# EAGLE design artik530_carrierboard (EAGLE 9.0.0)

## Sheet 1 of 4
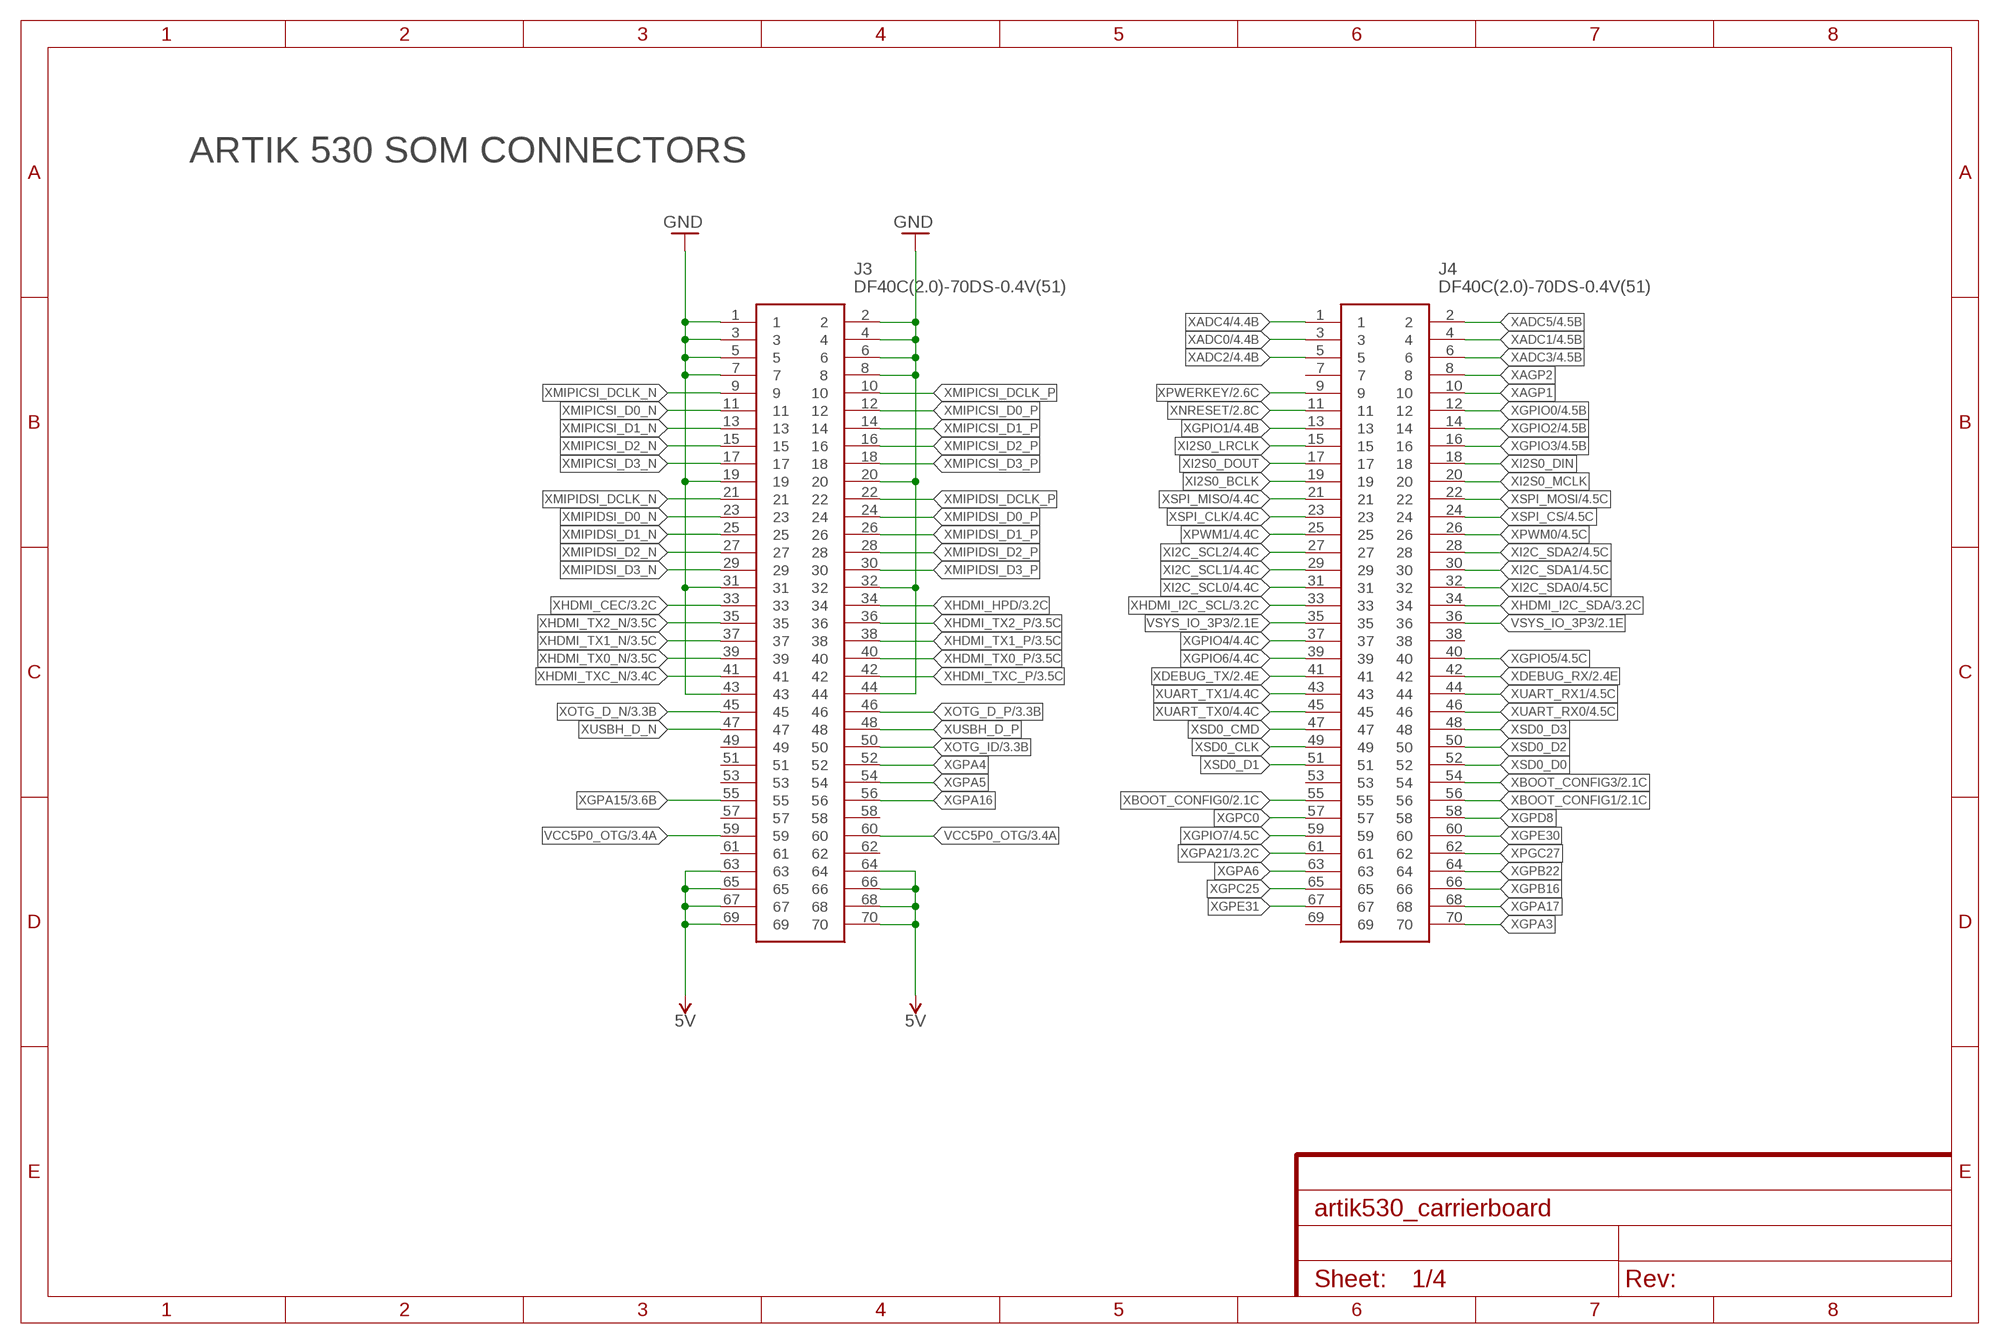
[diagram p0: schematic, sheet 1]

### Parts
J3  DF40C(2.0)-70DS-0.4V(51)  [DF40C(2.0)-70DS-0.4V(51)]
J4  DF40C(2.0)-70DS-0.4V(51)  [DF40C(2.0)-70DS-0.4V(51)]

### Nets
5V: J3.63 J3.64 J3.65 J3.66 J3.67 J3.68 J3.69 J3.70 ; also sheet 2,3,4
GND: J3.1 J3.2 J3.3 J3.4 J3.5 J3.6 J3.7 J3.8 J3.19 J3.20 J3.31 J3.32 J3.43 J3.44 ; also sheet 2,3,4
VCC5P0_OTG: J3.59 J3.60 ; also sheet 3
VSYS_IO_3P3: J4.35 J4.36 ; also sheet 2
XADC0: J4.3 ; also sheet 4
XADC1: J4.4 ; also sheet 4
XADC2: J4.5 ; also sheet 4
XADC3: J4.6 ; also sheet 4
XADC4: J4.1 ; also sheet 4
XADC5: J4.2 ; also sheet 4
XAGP1: J4.10
XAGP2: J4.8
XBOOT_CONFIG0: J4.55 ; also sheet 2
XBOOT_CONFIG1: J4.56 ; also sheet 2
XBOOT_CONFIG3: J4.54 ; also sheet 2
XDEBUG_RX: J4.42 ; also sheet 2
XDEBUG_TX: J4.41 ; also sheet 2
XGPA3: J4.70
XGPA4: J3.52
XGPA5: J3.54
XGPA6: J4.63
XGPA15: J3.55 ; also sheet 3
XGPA16: J3.56
XGPA17: J4.68
XGPA21: J4.61 ; also sheet 3
XGPB16: J4.66
XGPB22: J4.64
XGPC0: J4.57
XGPC25: J4.65
XGPD8: J4.58
XGPE30: J4.60
XGPE31: J4.67
XGPIO0: J4.12 ; also sheet 4
XGPIO1: J4.13 ; also sheet 4
XGPIO2: J4.14 ; also sheet 4
XGPIO3: J4.16 ; also sheet 4
XGPIO4: J4.37 ; also sheet 4
XGPIO5: J4.40 ; also sheet 4
XGPIO6: J4.39 ; also sheet 4
XGPIO7: J4.59 ; also sheet 4
XHDMI_CEC: J3.33 ; also sheet 3
XHDMI_HPD: J3.34 ; also sheet 3
XHDMI_I2C_SCL: J4.33 ; also sheet 3
XHDMI_I2C_SDA: J4.34 ; also sheet 3
XHDMI_TX0_N: J3.39 ; also sheet 3
XHDMI_TX0_P: J3.40 ; also sheet 3
XHDMI_TX1_N: J3.37 ; also sheet 3
XHDMI_TX1_P: J3.38 ; also sheet 3
XHDMI_TX2_N: J3.35 ; also sheet 3
XHDMI_TX2_P: J3.36 ; also sheet 3
XHDMI_TXC_N: J3.41 ; also sheet 3
XHDMI_TXC_P: J3.42 ; also sheet 3
XI2C_SCL0: J4.31 ; also sheet 4
XI2C_SCL1: J4.29 ; also sheet 4
XI2C_SCL2: J4.27 ; also sheet 4
XI2C_SDA0: J4.32 ; also sheet 4
XI2C_SDA1: J4.30 ; also sheet 4
XI2C_SDA2: J4.28 ; also sheet 4
XI2S0_BCLK: J4.19
XI2S0_DIN: J4.18
XI2S0_DOUT: J4.17
XI2S0_LRCLK: J4.15
XI2S0_MCLK: J4.20
XMIPICSI_D0_N: J3.11
XMIPICSI_D0_P: J3.12
XMIPICSI_D1_N: J3.13
XMIPICSI_D1_P: J3.14
XMIPICSI_D2_N: J3.15
XMIPICSI_D2_P: J3.16
XMIPICSI_D3_N: J3.17
XMIPICSI_D3_P: J3.18
XMIPICSI_DCLK_N: J3.9
XMIPICSI_DCLK_P: J3.10
XMIPIDSI_D0_N: J3.23
XMIPIDSI_D0_P: J3.24
XMIPIDSI_D1_N: J3.25
XMIPIDSI_D1_P: J3.26
XMIPIDSI_D2_N: J3.27
XMIPIDSI_D2_P: J3.28
XMIPIDSI_D3_N: J3.29
XMIPIDSI_D3_P: J3.30
XMIPIDSI_DCLK_N: J3.21
XMIPIDSI_DCLK_P: J3.22
XNRESET: J4.11 ; also sheet 2
XOTG_D_N: J3.45 ; also sheet 3
XOTG_D_P: J3.46 ; also sheet 3
XOTG_ID: J3.50 ; also sheet 3
XPGC27: J4.62
XPWERKEY: J4.9 ; also sheet 2
XPWM0: J4.26 ; also sheet 4
XPWM1: J4.25 ; also sheet 4
XSD0_CLK: J4.49
XSD0_CMD: J4.47
XSD0_D0: J4.52
XSD0_D1: J4.51
XSD0_D2: J4.50
XSD0_D3: J4.48
XSPI_CLK: J4.23 ; also sheet 4
XSPI_CS: J4.24 ; also sheet 4
XSPI_MISO: J4.21 ; also sheet 4
XSPI_MOSI: J4.22 ; also sheet 4
XUART_RX0: J4.46 ; also sheet 4
XUART_RX1: J4.44 ; also sheet 4
XUART_TX0: J4.45 ; also sheet 4
XUART_TX1: J4.43 ; also sheet 4
XUSBH_D_N: J3.47
XUSBH_D_P: J3.48
Unconnected: J3.49 J3.51 J3.53 J3.57 J3.58 J3.61 J3.62 J4.7 J4.38 J4.53 J4.69

### Notes on the sheet
- ARTIK 530 SOM CONNECTORS

## Sheet 2 of 4
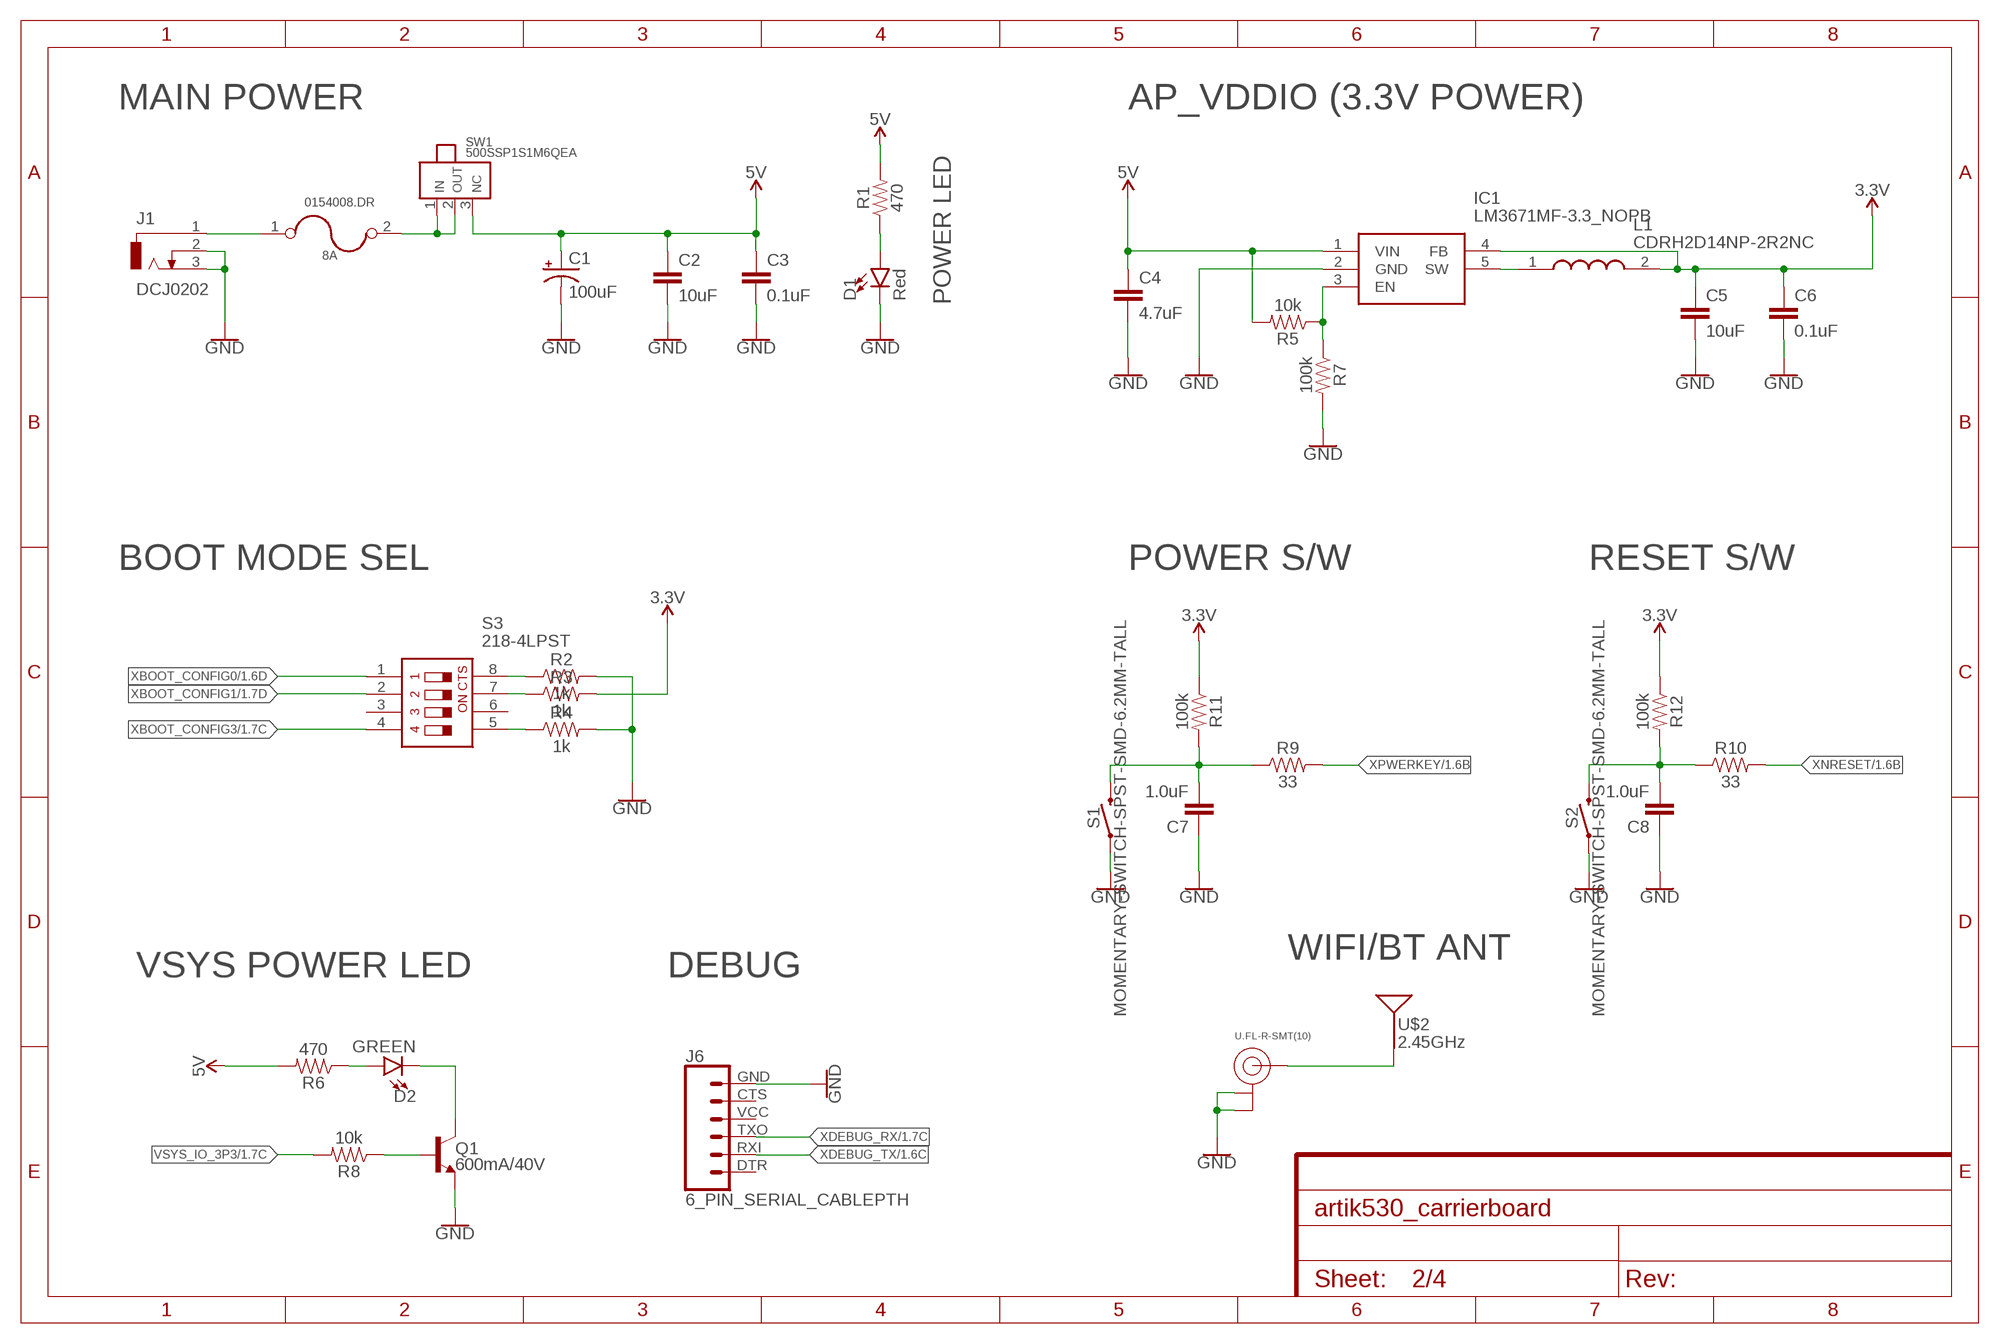
[diagram p1: schematic, sheet 2]

### Parts
C1  100uF  100UF-POLAR-EIA7343-10V-10%(TANT)  [EIA7343]
C2  10uF  10UF-0603-6.3V-20%  [0603]
C3  0.1uF  0.1UF-0603-25V-(+80/-20%)  [0603]
C4  4.7uF  4.7UF-0603-6.3V-(10%)  [0603]
C5  10uF  10UF-0603-6.3V-20%  [0603]
C6  0.1uF  0.1UF-0603-25V-(+80/-20%)  [0603]
C7  1.0uF  1.0UF-0603-16V-10%  [0603]
C8  1.0uF  1.0UF-0603-16V-10%  [0603]
D1  Red  LED-RED0603-SMART  [LED-0603]
D2  GREEN  LED-GREEN0603  [LED-0603]
IC1  LM3671MF-3.3_NOPB  [SOT95P284X122-5N]
J1  DCJ0202  [DCJ0202]
J6  6_PIN_SERIAL_CABLEPTH  [FTDI_BASIC]
L1  CDRH2D14NP-2R2NC  [CDRH2D14]
Q1  600mA/40V  TRANS_NPN-MMBT2222AL  [SOT23-3]
R1  470  470OHM-0603-1/10W-1%  [0603]
R2  1k  1KOHM-0603-1/10W-1%  [0603]
R3  1k  1KOHM-0603-1/10W-1%  [0603]
R4  1k  1KOHM-0603-1/10W-1%  [0603]
R5  10k  10KOHM-0603-1/10W-1%  [0603]
R6  470  470OHM-0603-1/10W-1%  [0603]
R7  100k  100KOHM-0603-1/10W-1%  [0603]
R8  10k  10KOHM-0603-1/10W-1%  [0603]
R9  33  33OHM-0603-1/10W-1%  [0603]
R10  33  33OHM-0603-1/10W-1%  [0603]
R11  100k  100KOHM-0603-1/10W-1%  [0603]
R12  100k  100KOHM-0603-1/10W-1%  [0603]
S1  MOMENTARY-SWITCH-SPST-SMD-6.2MM-TALL  [TACTILE_SWITCH_SMD_6.2MM_TALL]
S2  MOMENTARY-SWITCH-SPST-SMD-6.2MM-TALL  [TACTILE_SWITCH_SMD_6.2MM_TALL]
S3  218-4LPST  [SOIC127P844X265-8N]
SW1  500SSP1S1M6QEA  [500SSP1S1M6QEA]
U$1  0154008.DR  [0154008.DR]
U$2  2.45GHz  ANTENNA2.4GHZ-6.5X2.2MM  [ANT-2.4GHZ-6.5X2.2MM]
U$3  U.FL-R-SMT(10)  [U.FL-R-SMT(10)]

### Nets
3.3V: C5.1 C6.1 IC1.4(FB) L1.2 R3.2 R11.1 R12.1 ; also sheet 3,4
5V: C1.A(+) C2.1 C3.1 C4.1 IC1.1(VIN) R1.2 R5.2 R6.2 SW1.3(NC) ; also sheet 1,3,4
GND: C1.C(-) C2.2 C3.2 C4.2 C5.2 C6.2 C7.1 C8.1 D1.C IC1.2(GND) J1.2 J1.3 J6.GND Q1.2(E) R2.2 R4.2 R7.2 S1.A2 S2.A2 U$3.1(GND1) U$3.2(GND2) ; also sheet 1,3,4
N$1: J1.1 U$1.1
N$2: SW1.1(IN) SW1.2(OUT) U$1.2
N$3: IC1.5(SW) L1.1
N$4: D1.A R1.1
N$5: R2.1 S3.8
N$6: R3.1 S3.7
N$7: R4.1 S3.5
N$8: D2.A R6.1
N$9: IC1.3(EN) R5.1 R7.1
N$10: D2.C Q1.3(C)
N$11: Q1.1(B) R8.1
N$12: C7.2 R9.1 R11.2 S1.B2
N$13: C8.2 R10.1 R12.2 S2.B2
N$32: U$2.FEED(SIGNAL) U$3.3(SIG)
VSYS_IO_3P3: R8.2 ; also sheet 1
XBOOT_CONFIG0: S3.1 ; also sheet 1
XBOOT_CONFIG1: S3.2 ; also sheet 1
XBOOT_CONFIG3: S3.4 ; also sheet 1
XDEBUG_RX: J6.TXO ; also sheet 1
XDEBUG_TX: J6.RXI ; also sheet 1
XNRESET: R10.2 ; also sheet 1
XPWERKEY: R9.2 ; also sheet 1
Unconnected: J6.CTS J6.DTR J6.VCC S3.3 S3.6

### Notes on the sheet
- MAIN POWER | AP_VDDIO (3.3V POWER)
- POWER LED
- BOOT MODE SEL | POWER S/W | RESET S/W
- WIFI/BT ANT
- VSYS POWER LED | DEBUG

## Sheet 3 of 4
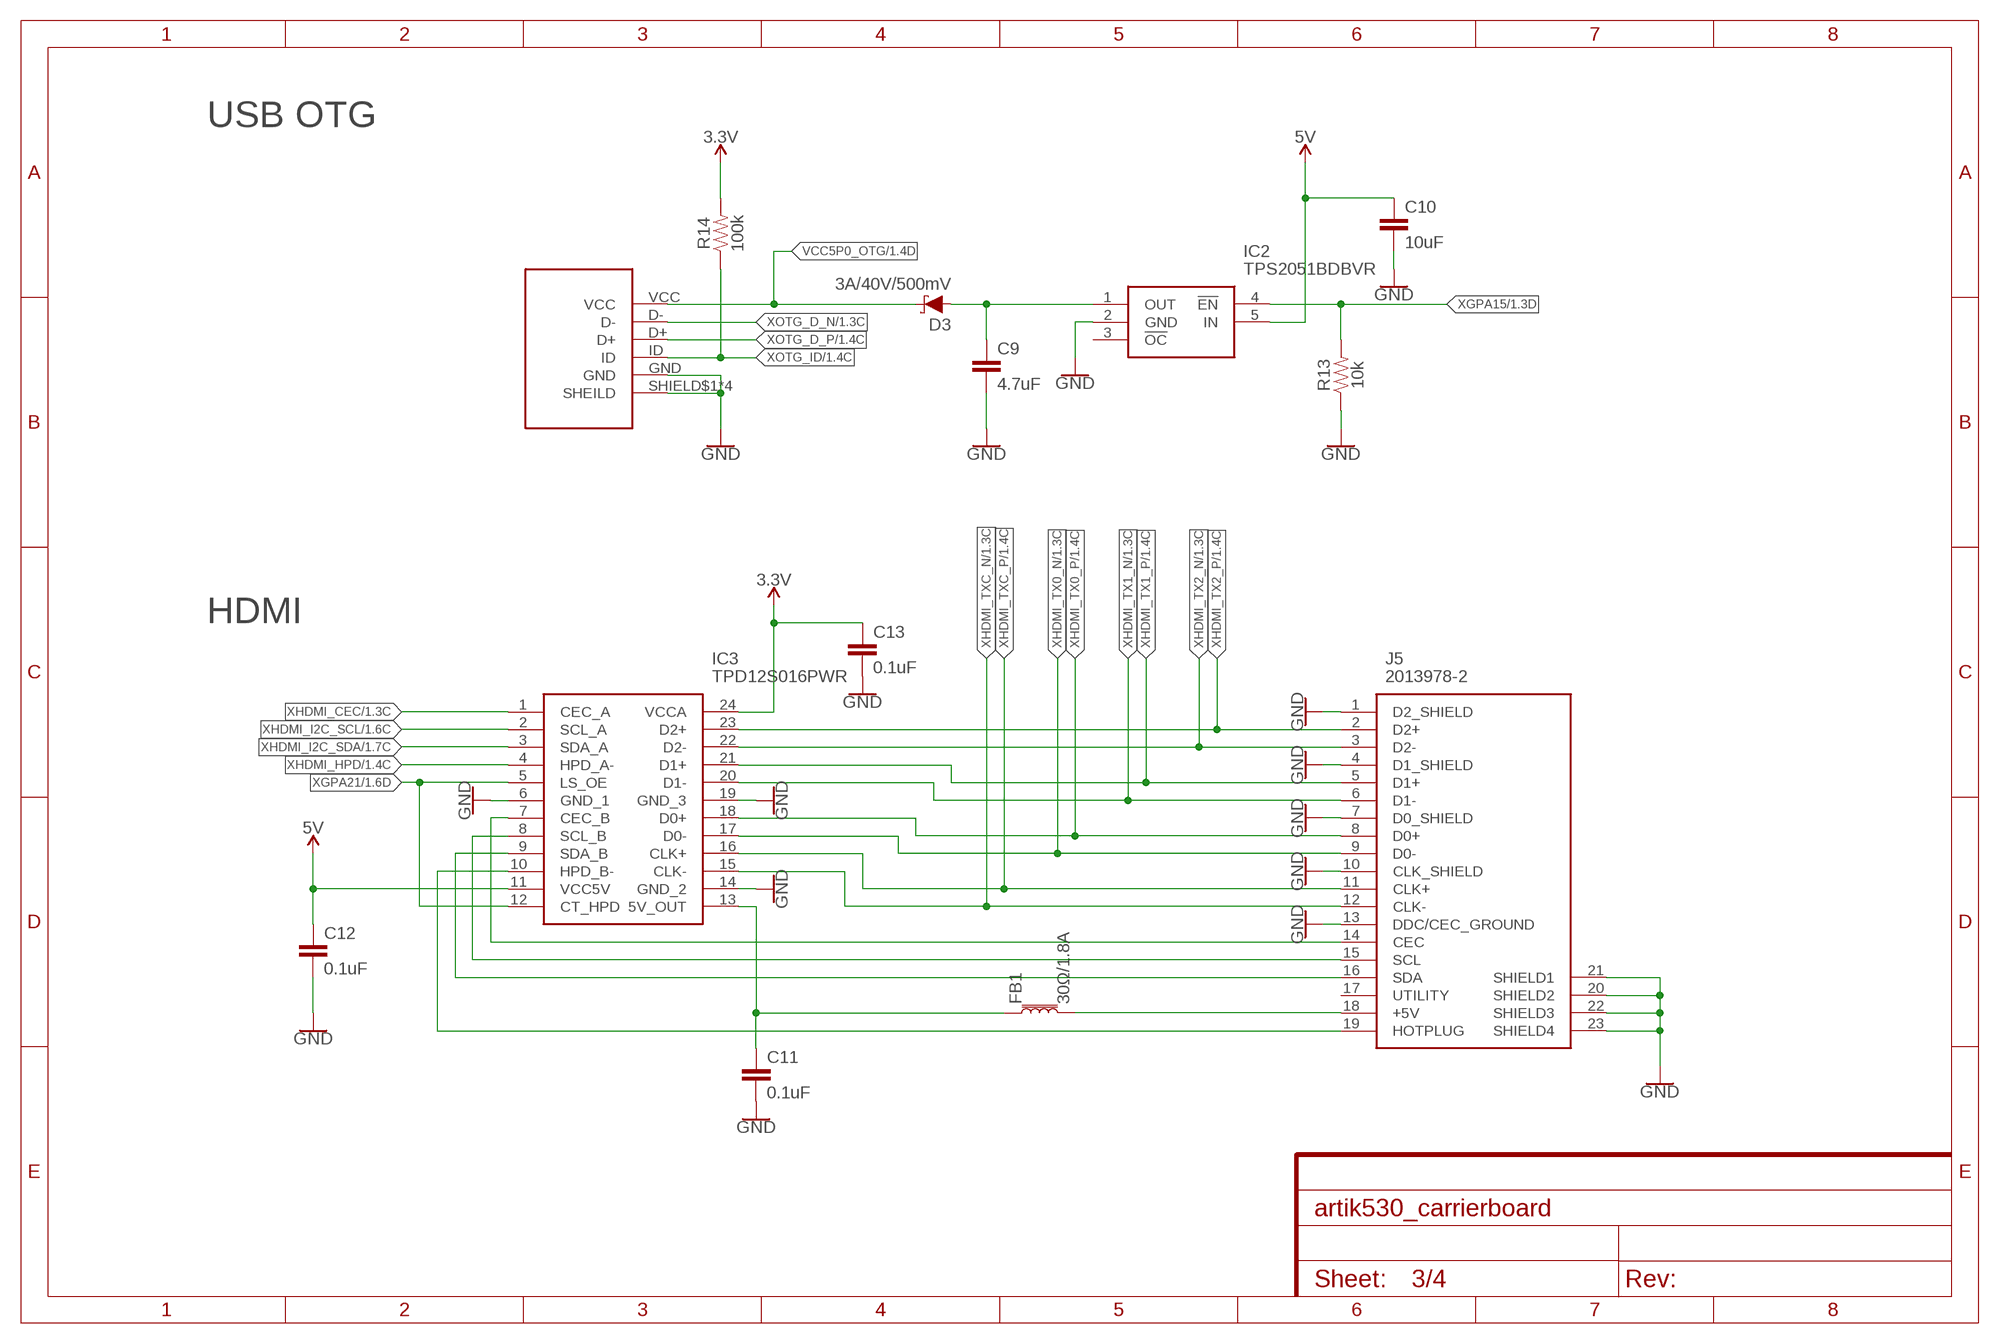
[diagram p2: schematic, sheet 3]

### Parts
C9  4.7uF  4.7UF-0603-6.3V-(10%)  [0603]
C10  10uF  10UF-0603-6.3V-20%  [0603]
C11  0.1uF  0.1UF-0603-25V-(+80/-20%)  [0603]
C12  0.1uF  0.1UF-0603-25V-(+80/-20%)  [0603]
C13  0.1uF  0.1UF-0603-25V-(+80/-20%)  [0603]
D3  3A/40V/500mV  DIODE-SCHOTTKY-B340A  [SMA-DIODE]
FB1  30Ω/1.8A  FERRITE_BEAD-0603  [0603]
IC2  TPS2051BDBVR  [SOT95P280X145-5N]
IC3  TPD12S016PWR  [SOP65P640X120-24N]
J2  10118193-0001LF  [10118193-0001LF]
J5  2013978-2  [20139782]
R13  10k  10KOHM-0603-1/10W-1%  [0603]
R14  100k  100KOHM-0603-1/10W-1%  [0603]

### Nets
3.3V: C13.1 IC3.24(VCCA) R14.2 ; also sheet 2,4
5V: C10.1 C12.1 IC2.5(IN) IC3.11(VCC5V) ; also sheet 1,2,4
GND: C9.2 C10.2 C11.2 C12.2 C13.2 IC2.2(GND) IC3.6(GND_1) IC3.14(GND_2) IC3.19(GND_3) J2.GND J2.SHIELD$1(SHEILD) J2.SHIELD$2(SHEILD) J2.SHIELD$3(SHEILD) J2.SHIELD$4(SHEILD) J5.1(D2_SHIELD) J5.4(D1_SHIELD) J5.7(D0_SHIELD) J5.10(CLK_SHIELD) J5.13(DDC/CEC_GROUND) J5.20(SHIELD2) J5.21(SHIELD1) J5.22(SHIELD3) J5.23(SHIELD4) R13.1 ; also sheet 1,2,4
N$14: C11.1 FB1.1 IC3.13(5V_OUT)
N$15: C9.1 D3.A IC2.1(OUT)
N$16: IC3.7(CEC_B) J5.14(CEC)
N$17: IC3.8(SCL_B) J5.15(SCL)
N$18: IC3.9(SDA_B) J5.16(SDA)
N$19: IC3.10(HPD_B-) J5.19(HOTPLUG)
N$27: FB1.2 J5.18(+5V)
VCC5P0_OTG: D3.C J2.VCC ; also sheet 1
XGPA15: IC2.4(!EN) R13.2 ; also sheet 1
XGPA21: IC3.5(LS_OE) IC3.12(CT_HPD) ; also sheet 1
XHDMI_CEC: IC3.1(CEC_A) ; also sheet 1
XHDMI_HPD: IC3.4(HPD_A-) ; also sheet 1
XHDMI_I2C_SCL: IC3.2(SCL_A) ; also sheet 1
XHDMI_I2C_SDA: IC3.3(SDA_A) ; also sheet 1
XHDMI_TX0_N: IC3.17(D0-) J5.9(D0-) ; also sheet 1
XHDMI_TX0_P: IC3.18(D0+) J5.8(D0+) ; also sheet 1
XHDMI_TX1_N: IC3.20(D1-) J5.6(D1-) ; also sheet 1
XHDMI_TX1_P: IC3.21(D1+) J5.5(D1+) ; also sheet 1
XHDMI_TX2_N: IC3.22(D2-) J5.3(D2-) ; also sheet 1
XHDMI_TX2_P: IC3.23(D2+) J5.2(D2+) ; also sheet 1
XHDMI_TXC_N: IC3.15(CLK-) J5.12(CLK-) ; also sheet 1
XHDMI_TXC_P: IC3.16(CLK+) J5.11(CLK+) ; also sheet 1
XOTG_D_N: J2.D- ; also sheet 1
XOTG_D_P: J2.D+ ; also sheet 1
XOTG_ID: J2.ID R14.1 ; also sheet 1
Unconnected: IC2.3(!OC) J5.17(UTILITY)

### Notes on the sheet
- USB OTG
- HDMI

## Sheet 4 of 4
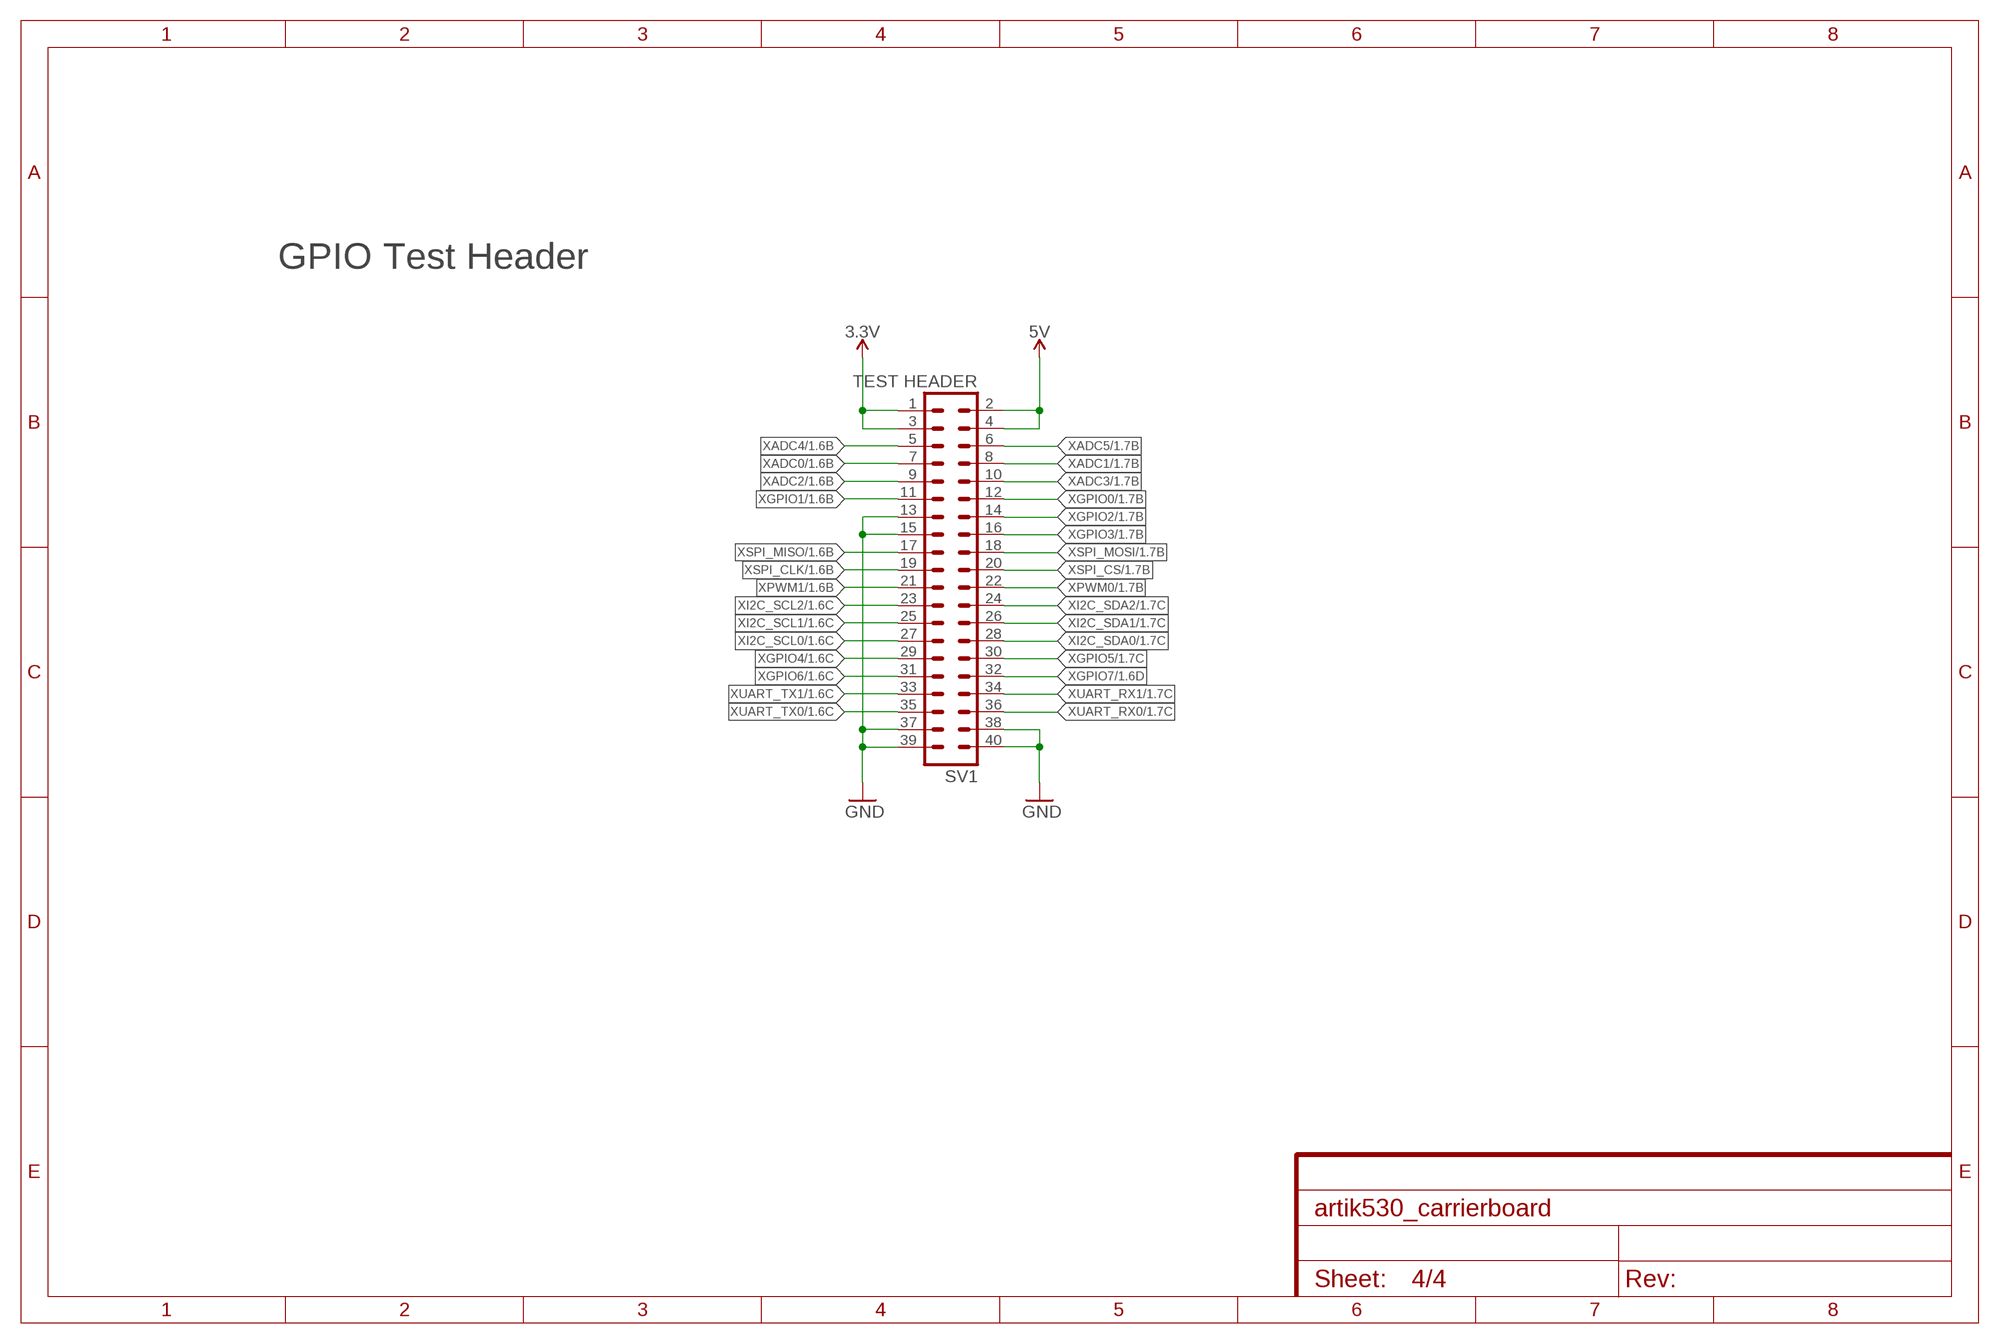
[diagram p3: schematic, sheet 4]

### Parts
SV1  TEST HEADER  MA20-2  [MA20-2]

### Nets
3.3V: SV1.1 SV1.3 ; also sheet 2,3
5V: SV1.2 SV1.4 ; also sheet 1,2,3
GND: SV1.13 SV1.15 SV1.37 SV1.38 SV1.39 SV1.40 ; also sheet 1,2,3
XADC0: SV1.7 ; also sheet 1
XADC1: SV1.8 ; also sheet 1
XADC2: SV1.9 ; also sheet 1
XADC3: SV1.10 ; also sheet 1
XADC4: SV1.5 ; also sheet 1
XADC5: SV1.6 ; also sheet 1
XGPIO0: SV1.12 ; also sheet 1
XGPIO1: SV1.11 ; also sheet 1
XGPIO2: SV1.14 ; also sheet 1
XGPIO3: SV1.16 ; also sheet 1
XGPIO4: SV1.29 ; also sheet 1
XGPIO5: SV1.30 ; also sheet 1
XGPIO6: SV1.31 ; also sheet 1
XGPIO7: SV1.32 ; also sheet 1
XI2C_SCL0: SV1.27 ; also sheet 1
XI2C_SCL1: SV1.25 ; also sheet 1
XI2C_SCL2: SV1.23 ; also sheet 1
XI2C_SDA0: SV1.28 ; also sheet 1
XI2C_SDA1: SV1.26 ; also sheet 1
XI2C_SDA2: SV1.24 ; also sheet 1
XPWM0: SV1.22 ; also sheet 1
XPWM1: SV1.21 ; also sheet 1
XSPI_CLK: SV1.19 ; also sheet 1
XSPI_CS: SV1.20 ; also sheet 1
XSPI_MISO: SV1.17 ; also sheet 1
XSPI_MOSI: SV1.18 ; also sheet 1
XUART_RX0: SV1.36 ; also sheet 1
XUART_RX1: SV1.34 ; also sheet 1
XUART_TX0: SV1.35 ; also sheet 1
XUART_TX1: SV1.33 ; also sheet 1

### Notes on the sheet
- GPIO Test Header

## Library data of the parts
C1 = SparkFun-Capacitors:100UF-POLAR: 100µF polarized capacitors A capacitor is a passive two-terminal electrical component used to store electrical energy temporarily in an electric field.; PROD_ID: CAP-07890
C2 C5 C10 = SparkFun-Capacitors:10UF: 10.0µF ceramic capacitors A capacitor is a passive two-terminal electrical component used to store electrical energy temporarily in an electric field.; PROD_ID: CAP-11015
C3 C6 C11-C13 = SparkFun-Capacitors:0.1UF: 0.1µF ceramic capacitors A capacitor is a passive two-terminal electrical component used to store electrical energy temporarily in an electric field.; PROD_ID: CAP-00810
C4 C9 = SparkFun-Capacitors:4.7UF: 4.7µF ceramic capacitors A capacitor is a passive two-terminal electrical component used to store electrical energy temporarily in an electric field.; PROD_ID: CAP-08280
C7 C8 = SparkFun-Capacitors:1.0UF: 1µF ceramic capacitors A capacitor is a passive two-terminal electrical component used to store electrical energy temporarily in an electric field.; PROD_ID: CAP-00868
D1 = SparkFun-LED:LED-RED: Red SMD LED Used in manufacturing of most products at SparkFun Packages: 0603 - SMD 0603 package [Product Link] <http://docs.avagotech.com/docs/AV02-0551EN> 0603 SMART - SMD 0603 SMART package ( more efficient and expensive)[Product Link] <http://www.osram-os.com/Graphics/XPic2/00077099_0.pdf> 1206 - SMD1206 package [Product Link] <https://www.sparkfun.com/datasheets/DevTools/LilyPad/Q150OVS4.pdff> SparkFun Products: Pro Mini 328 -5V <https://www.sparkfun.com/products/821> RedBoard <https://www.sparkfun.com/products/12757> IOIO-OTG <https://www.sparkfun.com/products/13613>; PROD_ID: DIO-11154
D2 = SparkFun-LED:LED-GREEN: Green SMD LED Used in manufacturing of various products at SparkFun Packages: 0603 - SMD 0603 package [Product Link] <http://www.futureelectronics.com/en/technologies/semiconductors/optoelectronics/leds/Pages/9894312-LTST-C190GKT.aspx?CrossPart=HSMG-C190&IM=0> LilyPad 1206 - SMD1206 LilyPad package [Product Link] <http://www.futureelectronics.com/en/Technologies/Product.aspx?ProductID=IN150NGHARVATEKCORPORATION2049943&IM=0> 1206 - SMD1206 package [Product Link] <http://www.futureelectronics.com/en/technologies/semiconductors/optoelectronics/leds/Pages/8315665-LTST-C150KGKT.aspx?IM=0> 1206 Bottom Mount -SMD 1206 Bottom Mount [Product Link] <http://www.digikey.com/product-detail/en/lite-on-inc/LTST-C230KGKT/160-1456-1-ND/386854> SparkFun Products: Pro Mini 328 -5V <https://www.sparkfun.com/products/821> RedBoard <https://www.sparkfun.com/products/12757> MP3 Trigger <https://www.sparkfun.com/products/13720> Makey Makey <https://www.sparkfun.com/products/11076>; PROD_ID: DIO-00821
D3 = SparkFun-DiscreteSemi:DIODE-SCHOTTKY: Schottky diode A Schottky diode is a semiconductor diode which has a low forward voltage drop and a very fast switching action.; PROD_ID: DIO-09886
FB1 = SparkFun-Coils:FERRITE_BEAD: Ferrite Bead (blocks, cores, rings, chokes, etc.) Inductor with layers of ferrite used to suppress high frequencies. Often used to isolate high frequency noise. SparkFun Products: IOIO-OTG - V2.2 <https://www.sparkfun.com/products/13613> SparkFun SAMD21 Mini Breakout <https://www.sparkfun.com/products/13664> SparkFun 6 Degrees of Freedom Breakout - LSM6DS3 <https://www.sparkfun.com/products/13339> SparkFun SAMD21 Dev Breakout <https://www.sparkfun.com/products/13672>; PROD_ID: NDUC-13805
IC1 = LM3671MF-3.3_NOPB:LM3671MF-3.3_NOPB: DC-DC Converter Step-Dn 2.7-5.5V SOT23-5 Texas Instruments LM3671MF-3.3/NOPB, Step Down DC-DC Converter, 600mA, Adjustable, 1.1 3.3 V, 5-Pin SOT-23 Source: Datasheet <http://www.ti.com/lit/ds/symlink/lm3671.pdf>; DESCRIPTION: DC-DC Converter Step-Dn 2.7-5.5V SOT23-5 Texas Instruments LM3671MF-3.3/NOPB, Step Down DC-DC Converter, 600mA, Adjustable, 1.1 3.3 V, 5-Pin SOT-23; DIGIKEY_PART_NUMBER: LM3671MF-3.3/NOPBTR-ND; HEIGHT: 1.22mm; MANUFACTURER_NAME: Texas Instruments; MANUFACTURER_PART_NUMBER: LM3671MF-3.3/NOPB
IC2 = TPS2051BDBVR:TPS2051BDBVR: TEXAS INSTRUMENTS - TPS2051BDBVR - CURRENT LIMITED POWER SWITCH, 5.5V SOT23-5, FULL REEL Source: Datasheet <http://www.ti.com/lit/ds/symlink/tps2051b.pdf>; ARROW_PART_NUMBER: TPS2051BDBVR; ARROW_PRICE/STOCK: https://www.arrow.com/en/products/tps2051bdbvr/texas-instruments; DESCRIPTION: TEXAS INSTRUMENTS - TPS2051BDBVR - CURRENT LIMITED POWER SWITCH, 5.5V SOT23-5, FULL REEL; HEIGHT: 1.45mm; MANUFACTURER_NAME: Texas Instruments; MANUFACTURER_PART_NUMBER: TPS2051BDBVR
IC3 = TPD12S016PWR:TPD12S016PWR: Texas Instruments,TPD12S016PWR,IC,HDMI TPD12S016PWR, HDMI Interface 12-channel HDMI 4.5 Source: Datasheet <http://www.ti.com/lit/ds/symlink/tpd12s016.pdf>; ARROW_PART_NUMBER: TPD12S016PWR; ARROW_PRICE/STOCK: https://www.arrow.com/en/products/tpd12s016pwr/texas-instruments; DESCRIPTION: Texas Instruments,TPD12S016PWR,IC,HDMI TPD12S016PWR, HDMI Interface 12-channel HDMI 4.5; HEIGHT: 1.2mm; MANUFACTURER_NAME: Texas Instruments; MANUFACTURER_PART_NUMBER: TPD12S016PWR; RS_PART_NUMBER: 1627865; RS_PRICE/STOCK: http://uk.rs-online.com/web/p/products/1627865
J1 = con-jack:DCJ0202: DC POWER JACK Source: DCJ0202.pdf; OC_FARNELL: unknown; OC_NEWARK: unknown
J2 = 10118193-0001LF:10118193-0001LF
J3 J4 = DF40C(2.0)-70DS-0.4V(51):DF40C(2.0)-70DS-0.4V(51): HIROSE(HRS) - DF40C(2.0)-70DS-0.4V(51) - CONNECTOR, STACKING, RCPT, 70POS, 2ROW Source: Datasheet <https://www.hirose.co.jp/cataloge_hp/ed_DF40_20140305.pdf>; ARROW_PART_NUMBER: DF40C(2.0)-70DS-0.4V(51); ARROW_PRICE/STOCK: https://www.arrow.com/en/products/df40c-2.0-70ds-0.4v-51/hirose-electric; DESCRIPTION: HIROSE(HRS) - DF40C(2.0)-70DS-0.4V(51) - CONNECTOR, STACKING, RCPT, 70POS, 2ROW; HEIGHT: mm; MANUFACTURER_NAME: Hirose; MANUFACTURER_PART_NUMBER: DF40C(2.0)-70DS-0.4V(51)
J5 = 2013978-2:2013978-2: TE CONNECTIVITY - 2013978-2 - RECEPTACLE, HDMI, MINI, C, FLANGE Source: Datasheet <http://www.te.com/commerce/DocumentDelivery/DDEController?Action=showdoc&DocId=Customer Drawing2013978B1pdfEnglishENG_CD_2013978_B1.pdf2013978-2>; ARROW_PART_NUMBER: 2013978-2; ARROW_PRICE/STOCK: https://www.arrow.com/en/products/2013978-2/te-connectivity; DESCRIPTION: TE CONNECTIVITY - 2013978-2 - RECEPTACLE, HDMI, MINI, C, FLANGE; HEIGHT: 3mm; MANUFACTURER_NAME: TE Connectivity; MANUFACTURER_PART_NUMBER: 2013978-2
J6 = SparkFun-Connectors:6_PIN_SERIAL_CABLE: 6-pin header connection for use with the "FTDI BASIC" pinout - CABLE SIDE. Also known as "Arduino Serial Program Header". This is used on a design to provide a 6-pin connection point for serial communication usually from a USB cable (D+/D-) to these headers (RX/TX). It also has the remaining pins necessary for programming in the Arduino evironment (DTR, GND, and sometimes VCC). Note, this device has "CABLE" in the name. It is intended to be used on a design that usually lives on the end of your USB cable and prvides the converter chip (FTDI232 or FTDI231x) to commnicate serial RX/TX. The "sister" device, named "TARGET" is inteneded to be used on a design that contains a target micro-controller that you wish to program. You can populate with some of these: Female Headers <https://www.sparkfun.com/products/115> (PRT-00115) For reference (or to suit your programming needs) check out these designs: SparkFun FTDI Basic Breakout - 5V <https://www.sparkfun.com/products/9716> (DEV-09716) SparkFun FTDI Basic Breakout - 3.3V <https://www.sparkfun.com/products/9873> (DEV-09873) SparkFun FTDI SmartBasic <https://www.sparkfun.com/products/12935> (DEV-12935) SparkFun Beefy 3 - FTDI Basic Breakout <https://www.sparkfun.com/products/13746> (DEV-13746)
L1 = CDRH2D14NP-2R2NC:CDRH2D14NP-2R2NC: Fixed Inductors 2.2uH 1.60A 75ohms Source: Datasheet <http://www.mouser.com/ds/2/390/CDRH2D14-523410.pdf>; ARROW_PART_NUMBER: CDRH2D14NP-2R2NC; ARROW_PRICE/STOCK: https://www.arrow.com/en/products/cdrh2d14np-2r2nc/sumida; DESCRIPTION: Fixed Inductors 2.2uH 1.60A 75ohms; HEIGHT: mm; MANUFACTURER_NAME: Sumida; MANUFACTURER_PART_NUMBER: CDRH2D14NP-2R2NC
Q1 = SparkFun-DiscreteSemi:TRANS_NPN: NPN transistor Current controlled devices typically used to amplify current or used as a switch. BC547 - COM-08928 <http://www.sparkfun.com/products/8928> (TO-92 45V 100mA) (1.Collector 2.Base 3.Emitter) 2N3904 - COM-00521 <http://www.sparkfun.com/products/521> (TO-92 40V 200mA) (1.Emitter 2.Base 3.Collector) P2N2222A - COM-12852 <http://www.sparkfun.com/products/12852> (TO-92 40V 600mA) (1.Collector 2.Base 3.Emitter); PROD_ID: TRANS-08049
R1 R6 = SparkFun-Resistors:470OHM: 470Ω resistor A resistor is a passive two-terminal electrical component that implements electrical resistance as a circuit element. Resistors act to reduce current flow, and, at the same time, act to lower voltage levels within circuits. - Wikipedia; PROD_ID: RES-07869
R2-R4 = SparkFun-Resistors:1KOHM: 1kΩ resistor A resistor is a passive two-terminal electrical component that implements electrical resistance as a circuit element. Resistors act to reduce current flow, and, at the same time, act to lower voltage levels within circuits. - Wikipedia; PROD_ID: RES-07856
R5 R8 R13 = SparkFun-Resistors:10KOHM: 10kΩ resistor A resistor is a passive two-terminal electrical component that implements electrical resistance as a circuit element. Resistors act to reduce current flow, and, at the same time, act to lower voltage levels within circuits. - Wikipedia; PROD_ID: RES-00824
R7 R11 R12 R14 = SparkFun-Resistors:100KOHM: 100kΩ resistor A resistor is a passive two-terminal electrical component that implements electrical resistance as a circuit element. Resistors act to reduce current flow, and, at the same time, act to lower voltage levels within circuits. - Wikipedia; PROD_ID: RES-07828
R9 R10 = SparkFun-Resistors:33OHM: 33Ω resistor A resistor is a passive two-terminal electrical component that implements electrical resistance as a circuit element. Resistors act to reduce current flow, and, at the same time, act to lower voltage levels within circuits. - Wikipedia; PROD_ID: RES-08270
S1 S2 = SparkFun-Switches:MOMENTARY-SWITCH-SPST: Momentary Switch (Pushbutton) - SPST Normally-open (NO) SPST momentary switches (buttons, pushbuttons). Variants PTH-12MM - 12mm square, through-hole Momentary Pushbutton Switch - 12mm Square <https://www.sparkfun.com/products/9190> (COM-09190) PTH-6.0MM, PTH-6.0MM-KIT - 6.0mm square, through-hole Mini Pushbutton Switch <https://www.sparkfun.com/products/97> (COM-00097) KIT package intended for soldering kit's - only one side of pads' copper is exposed. PTH-RIGHT-ANGLE-KIT - Right-angle, through-hole Right Angle Tactile Button <https://www.sparkfun.com/products/10791> - Used on SparkFun BigTime Watch Kit <https://www.sparkfun.com/products/11734> SMD-12MM - 12mm square, surface-mount Tactile Button - SMD (12mm) <https://www.sparkfun.com/products/12993> (COM-12993) Used on SparkFun PicoBoard <https://www.sparkfun.com/products/11888> SMD-4.5MM - 4.5mm Square Trackball Switch Used on SparkFun Blackberry Trackballer Breakout <https://www.sparkfun.com/products/13169> SMD-4.6MMX2.8MM - 4.60mm x 2.80mm, surface mount Used on SparkFun SAMD21 Mini Breakout <https://www.sparkfun.com/products/13664> SMD-5.2MM, SMD-5.2-REDUNDANT - 5.2mm square, surface-mount Mini Pushbutton Switch - SMD <https://www.sparkfun.com/products/8720> (COM-08720) Used on Arduino Pro Mini <https://www.sparkfun.com/products/11114> REDUNDANT package connects both switch circuits together SMD-6.0X3.5MM - 6.0 x 3.5mm, surface mount Momentary Reset Switch SMD <https://www.sparkfun.com/products/8229> (COM-08229) SMD-6.2MM-TALL - 6.2mm square, surface mount Tactile Button - SMD (6mm) <https://www.sparkfun.com/products/12992> Used on SparkFun Digital Sandbox <https://www.sparkfun.com/products/12651> SMD-RIGHT-ANGLE - Right-angle, surface mount Used on SparkFun Block for Intel® Edison - Arduino <https://www.sparkfun.com/products/13036>; PROD_ID: SWCH-11966; SF_SKU: COM-12992
S3 = 218-4LPST:218-4LPST: Half Pitch, SMD DIP Switch Source: Datasheet <https://www.ctscorp.com/wp-content/uploads/218.pdf>; ARROW_PART_NUMBER: 218-4LPST; ARROW_PRICE/STOCK: https://www.arrow.com/en/products/218-4lpst/cts; DESCRIPTION: Half Pitch, SMD DIP Switch; HEIGHT: 2.65mm; MANUFACTURER_NAME: CTS; MANUFACTURER_PART_NUMBER: 218-4LPST
SV1 = con-lstb:MA20-2: PIN HEADER; OC_FARNELL: unknown; OC_NEWARK: unknown
SW1 = ARTIK530_EAGLE_LIB:500SSP1S1M6QEA
U$1 = ARTIK530_EAGLE_LIB:0154008.DR: FUSE 8A
U$2 = SparkFun-RF:ANTENNA: Single-ended Antennae 2.4GHz and antennae with just one terminal. These are all chip antennae. 2.4GHz (WiFi/BT/ZigBee) Antennae ANT-2.4GHZ-6.5X2.2MM - 6.5 x 2.2 mm chip antenna. (SparkFun Product <https://www.sparkfun.com/products/144>) ANT-2.4GHZ8.0X1.0MM - 8.0 x 1.0 mm chip antenna. (Datasheet <http://www.mouser.com/ds/2/611/antenna_2500at44m0400-242425.pdf>) ANT-2.4GHZ9.5X2.0MM - 9.5 x 2.0 mm chip antenna. (SparkFun Product <https://www.sparkfun.com/products/9025>); PROD_ID: ANT-08187; SF_ID: WRL-00144
U$3 = ARTIK530_EAGLE_LIB:U.FL-R-SMT(10)

## Net classes
1 differential: width 0.127 mm, drill 0.3 mm, clearance 0.127 mm

## Board
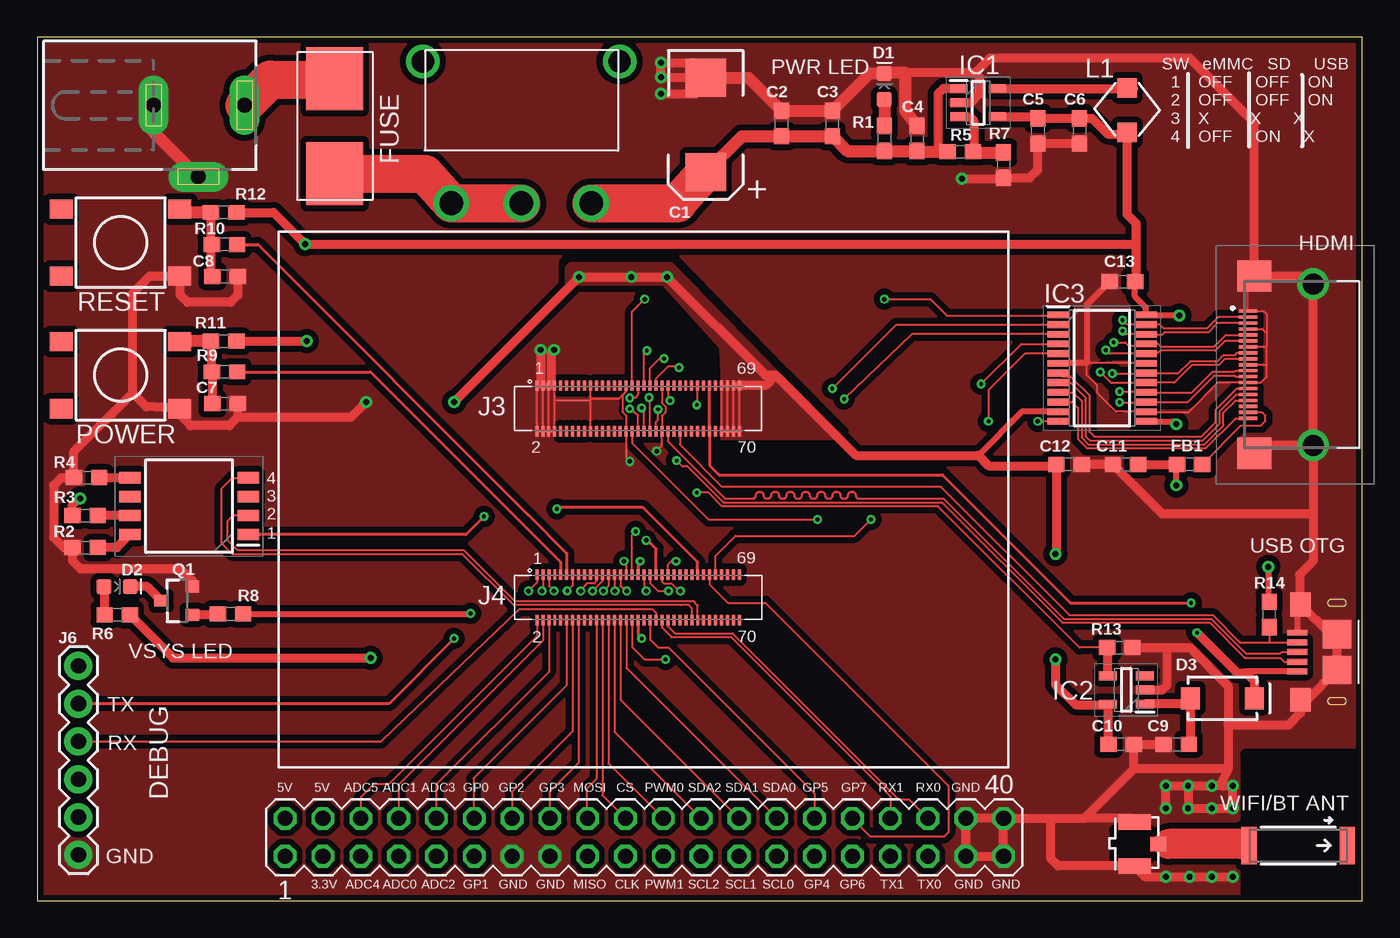
[diagram p4: board, top side]
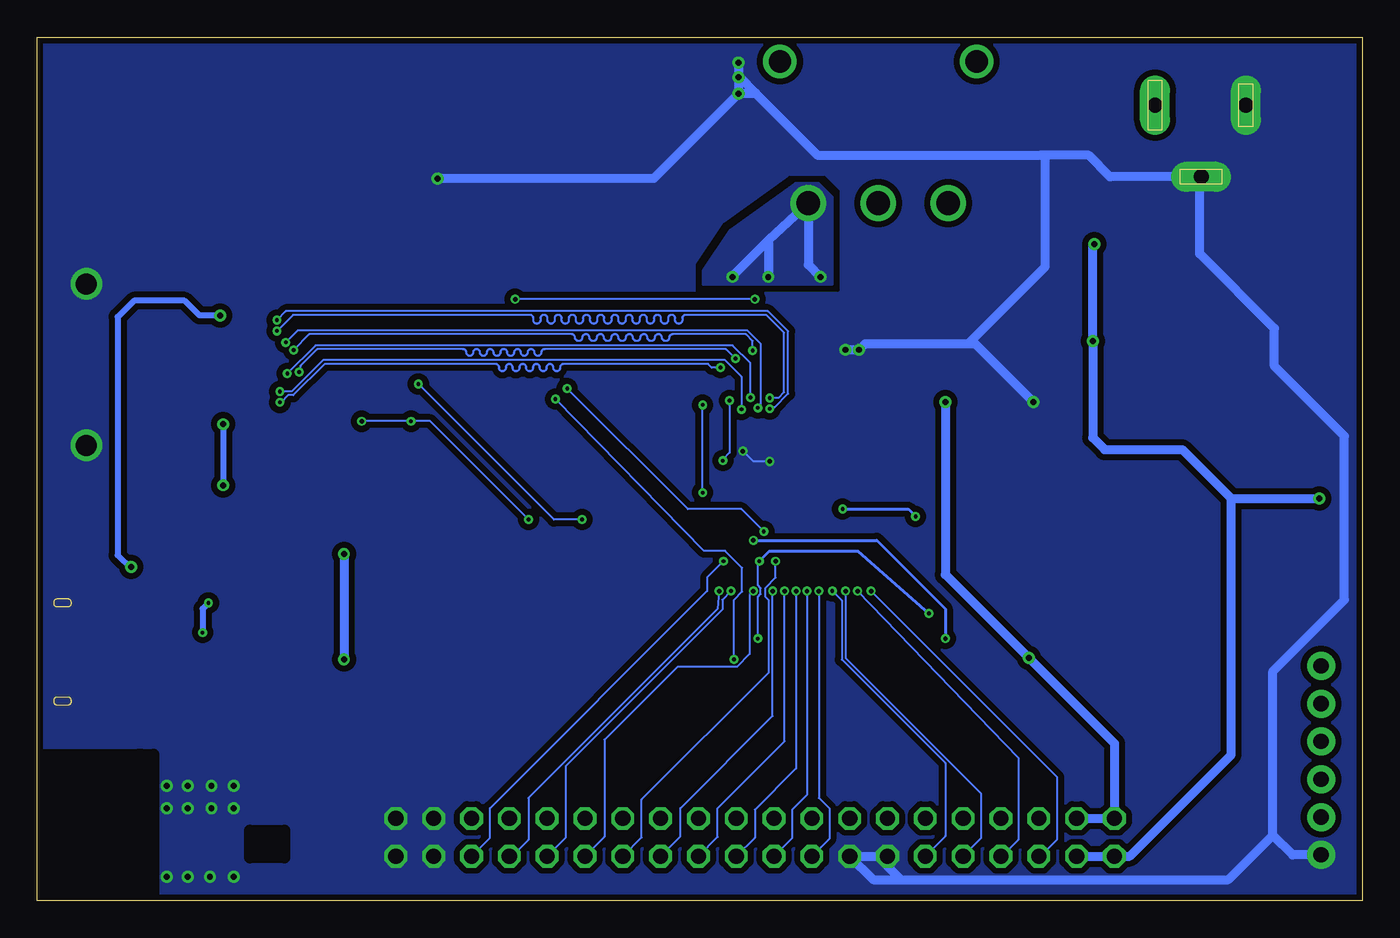
[diagram p5: board, bottom side, seen from below]

Size 89 x 58 mm. Coordinates in mm from the lower left corner, seen from the top.
Outline: 0,0 89,0 89,58 0,58 0,0
Copper layers (1*16): Top 0.035559375mm / dielectric 1.6mm / Bottom 0.035559375mm
Design rules "oshpark-2layer *": minimum track width 5mil, minimum drill 10mil, track to track 5mil, track to pad 5mil, pad to pad 5mil, via to via 5mil, smd to smd 5mil, copper to edge 15mil, drill to drill 6mil, minimum pad ring 5mil, minimum via ring 5mil, stop-mask expansion 2.5mil, vias tented up to drill 16mil, thermal gap 10mil
tRestrict: area 82,0 to 89.5,9.8; area 81.2,5.1 to 82.2,9.8; area 81.2,-0.1 to 82.2,2.4; area 72.4,2.9 to 74.7,4.7
bRestrict: area 81.2,5.1 to 82.2,9.8; area 81.2,-0.1 to 82.2,2.4; area 82,0 to 89.5,9.8; area 72.4,2.9 to 74.7,4.7; area 81.2,1.5 to 82.2,6.2

### Footprints (pad centres in the part's own frame; a part is rotated, then mirrored left to right if it is on the bottom)
EIA7343 = smd 2.55 x 2.7: A 3.17,0; C -3.17,0
0603 = smd 1.1 x 1: 1 -0.85,0; 2 0.85,0
LED-0603 = smd 1 x 1: A -0.877,0; C 0.877,0
SMA-DIODE = smd 1.27 x 1.47: A -2.15,0; C 2.15,0
SOT95P284X122-5N = smd 1.15 x 0.6: 1 -1.3,0.953; 2 -1.3,0; 3 -1.3,-0.953; 4 1.3,-0.953; 5 1.3,0.953
SOT95P280X145-5N = smd 1.2 x 0.6: 1 -1.25,0.95; 2 -1.25,0; 3 -1.25,-0.95; 4 1.25,-0.95; 5 1.25,0.95
SOP65P640X120-24N = smd 1.475 x 0.45: 1 -2.938,3.575; 2 -2.938,2.925; 3 -2.938,2.275; 4 -2.938,1.625; 5 -2.938,0.975; 6 -2.938,0.325; 7 -2.938,-0.325; 8 -2.938,-0.975; 9 -2.938,-1.625; 10 -2.938,-2.275; 11 -2.938,-2.925; 12 -2.938,-3.575; 13 2.938,-3.575; 14 2.938,-2.925; 15 2.938,-2.275; 16 2.938,-1.625; 17 2.938,-0.975; 18 2.938,-0.325; 19 2.938,0.325; 20 2.938,0.975; 21 2.938,1.625; 22 2.938,2.275; 23 2.938,2.925; 24 2.938,3.575
DCJ0202 = drill 1 pad 2 long: 1 0,3.1; 2 4.8,0; 3 0,-3
10118193-0001LF = smd 0.4 x 1.35: D+ 0,2.675; D- -0.65,2.675; GND 1.3,2.675; ID 0.65,2.675; VCC -1.3,2.675 | smd 1.6 x 1.4: SHIELD$1 -3.2,2.45; SHIELD$2 3.2,2.45 | smd 1.9 x 1.9: SHIELD$3 -1.2,0; SHIELD$4 1.2,0
DF40C(2.0)-70DS-0.4V(51) = smd 0.2 x 0.7: 1 0,0; 2 0,-3.08; 3 0.4,0; 4 0.4,-3.08; 5 0.8,0; 6 0.8,-3.08; 7 1.2,0; 8 1.2,-3.08; 9 1.6,0; 10 1.6,-3.08; 11 2,0; 12 2,-3.08; 13 2.4,0; 14 2.4,-3.08; 15 2.8,0; 16 2.8,-3.08; 17 3.2,0; 18 3.2,-3.08; 19 3.6,0; 20 3.6,-3.08; 21 4,0; 22 4,-3.08; 23 4.4,0; 24 4.4,-3.08; 25 4.8,0; 26 4.8,-3.08; 27 5.2,0; 28 5.2,-3.08; 29 5.6,0; 30 5.6,-3.08; 31 6,0; 32 6,-3.08; 33 6.4,0; 34 6.4,-3.08; 35 6.8,0; 36 6.8,-3.08; 37 7.2,0; 38 7.2,-3.08; 39 7.6,0; 40 7.6,-3.08; 41 8,0; 42 8,-3.08; 43 8.4,0; 44 8.4,-3.08; 45 8.8,0; 46 8.8,-3.08; 47 9.2,0; 48 9.2,-3.08; 49 9.6,0; 50 9.6,-3.08; 51 10,0; 52 10,-3.08; 53 10.4,0; 54 10.4,-3.08; 55 10.8,0; 56 10.8,-3.08; 57 11.2,0; 58 11.2,-3.08; 59 11.6,0; 60 11.6,-3.08; 61 12,0; 62 12,-3.08; 63 12.4,0; 64 12.4,-3.08; 65 12.8,0; 66 12.8,-3.08; 67 13.2,0; 68 13.2,-3.08; 69 13.6,0; 70 13.6,-3.08
20139782 = smd 1.25 x 0.22: 1 3.175,-3.6; 2 3.175,-3.2; 3 3.175,-2.8; 4 3.175,-2.4; 5 3.175,-2; 6 3.175,-1.6; 7 3.175,-1.2; 8 3.175,-0.8; 9 3.175,-0.4; 10 3.175,0; 11 3.175,0.4; 12 3.175,0.8; 13 3.175,1.2; 14 3.175,1.6; 15 3.175,2; 16 3.175,2.4; 17 3.175,2.8; 18 3.175,3.2; 19 3.175,3.6 | smd 2.3 x 2.1: 20 2.75,5.95; 21 2.75,-5.95 | drill 1.414 pad 2.121: 22 -1.2,5.425; 23 -1.2,-5.425
FTDI_BASIC = drill 1.016 pad 1.88: CTS 10.16,0; DTR 0,0; GND 12.7,0; RXI 2.54,0; TXO 5.08,0; VCC 7.62,0
CDRH2D14 = smd 1.3 x 1.3: 1 -1.5,0; 2 1.5,0
SOT23-3 = smd 0.8 x 0.9: 1 -0.95,-1; 2 0.95,-1; 3 0,1.1
TACTILE_SWITCH_SMD_6.2MM_TALL = smd 1.55 x 1.3: A1 -3.975,-2.25; A2 3.975,-2.25; B1 -3.975,2.25; B2 3.975,2.25
SOIC127P844X265-8N = smd 1.45 x 0.75: 1 -3.975,1.905; 2 -3.975,0.635; 3 -3.975,-0.635; 4 -3.975,-1.905; 5 3.975,-1.905; 6 3.975,-0.635; 7 3.975,0.635; 8 3.975,1.905
MA20-2 = drill 1.016 octagon: 1 -24.13,-1.27; 2 -24.13,1.27; 3 -21.59,-1.27; 4 -21.59,1.27; 5 -19.05,-1.27; 6 -19.05,1.27; 7 -16.51,-1.27; 8 -16.51,1.27; 9 -13.97,-1.27; 10 -13.97,1.27; 11 -11.43,-1.27; 12 -11.43,1.27; 13 -8.89,-1.27; 14 -8.89,1.27; 15 -6.35,-1.27; 16 -6.35,1.27; 17 -3.81,-1.27; 18 -3.81,1.27; 19 -1.27,-1.27; 20 -1.27,1.27; 21 1.27,-1.27; 22 1.27,1.27; 23 3.81,-1.27; 24 3.81,1.27; 25 6.35,-1.27; 26 6.35,1.27; 27 8.89,-1.27; 28 8.89,1.27; 29 11.43,-1.27; 30 11.43,1.27; 31 13.97,-1.27; 32 13.97,1.27; 33 16.51,-1.27; 34 16.51,1.27; 35 19.05,-1.27; 36 19.05,1.27; 37 21.59,-1.27; 38 21.59,1.27; 39 24.13,-1.27; 40 24.13,1.27
500SSP1S1M6QEA = drill 1.6: 1 -4.8,-5.4; 2 -0.1,-5.4; 3 4.6,-5.4 | drill 1.5: 4 -6.705,4.13; 5 6.505,4.13
0154008.DR = smd 4.24 x 3.81: 1 -3.15,-0.02; 2 3.23,-0.02
ANT-2.4GHZ-6.5X2.2MM = smd 1.016 x 2.54: FEED -3.302,0; NC 3.302,0
U.FL-R-SMT(10) = smd 1.05 x 2.2: 1 -1.475,0.2; 2 1.475,0.2 | smd 1 x 1.05: 3 0,-1.4

### Placement (x,y rotation side)
C1  44.9,52.1 270 top
C2  50,52.2 90 top
C3  53.4,52.2 90 top
C4  59.1,51.2 90 top
C5  67.2,51.7 270 top
C6  70,51.7 270 top
C7  12.62,33.38 180 top
C8  12.62,41.93 180 top
C9  76.5,10.5 180 top
C10  72.8,10.5 0 top
C11  73.1,29.3 180 top
C12  69.3,29.3 0 top
C13  72.89,41.58 180 top
D1  56.9,54.7 90 top
D2  5.37,21.1 0 top
D3  79.6,13.59 0 top
FB1  77.4,29.3 0 top
IC1  63.2,53.6 0 top
IC2  73.15,14.15 180 top
IC3  71.52,35.77 0 top
J1  10.82,53.43 270 top
J2  87.3,16.7 90 top
J3  33.56,34.6 0 top
J4  33.56,21.91 0 top
J5  84.5,36 180 top
J6  2.77,15.77 270 top
L1  73.2,53.1 270 top
Q1  9.42,20.15 90 top
R1  56.9,51.2 270 top
R2  3.21,23.71 180 top
R3  3.21,25.86 180 top
R4  3.31,28.41 180 top
R5  62,50.3 180 top
R6  5.38,19.2 0 top
R7  64.9,49.4 270 top
R8  12.98,19.25 0 top
R9  12.58,35.52 0 top
R10  12.58,44.07 0 top
R11  12.52,37.58 180 top
R12  12.52,46.23 180 top
R13  72.7,17 180 top
R14  82.75,19.21 90 top
S1  5.6,35.3 0 top
S2  5.6,44.2 0 top
S3  10.2,26.5 180 top
SV1  40.78,4.25 0 top
SW1  32.61,52.25 0 top
U$1  19.99,52.06 270 top
U$2  84.7,3.7 0 top
U$3  73.9,3.8 90 top

### Tracks (layer width: path | path; a pad name or v marks a point on that pad's centre or on a via)
3.3V  (via drill 0.4 pad 0.8)
  Top 0.127: C13.1 73.8,41.52 | 74.4,39.4 IC3.24
  Top 0.406: C13.1 73.74,40.56 74.46,39.84 IC3.24 76.66,39.34 v76.7,39.3 | v82.7,22.4 82.7,20.11 R14.2
  Top 0.61: IC1.4 67.1,52.65 C5.1 C6.1 70.85,52.55 71.9,51.5 73.1,51.5 L1.2 73.2,46.1 73.8,45.5 73.8,43.9 | 73.8,43.9 73.8,41.64 C13.1 | R12.1 15.87,46.23 v18,44.1 73.6,44.1 73.8,43.9 | R11.1 17.98,37.58 18,37.6 v18.1,37.6 | R3.2 2.36,26.56 2.8,27 v2.9,27
  Bottom 0.406: v76.7,39.3 78.1,39.3 79.1,40.3 82.5,40.3 83.6,39.2 83.6,23.2 82.7,22.3 v82.7,22.4
  Bottom 0.61: v18,44.1 18.1,44.1 v18.1,37.6 18.1,31.1 17.3,30.3 12.1,30.3 8.8,27 | SV1.3 SV1.1 15.62,2.98 8.8,9.8 8.8,27 | 8.8,27 v2.9,27
5V  (via drill 0.4 pad 0.8)
  Top 0.127: J3.66 J3.65 | J3.68 J3.67 | 47.16,34.5 J3.70 J3.68 | 47.16,34.5 J3.69 | J3.66 J3.64 J3.63 J3.65 | J3.66 J3.68 | J3.65 J3.67 | J3.67 47.06,34.6 47.16,34.5
  Top 0.406: IC3.11 66.14,32.84 63.2,29.9
  Top 0.61: IC1.1 60.85,54.55 60.5,54.2 60.5,50.3 | C10.1 71.95,13.15 | 71.95,13.15 IC2.5 | v68.4,23.3 68.45,23.35 C12.1 68.35,29.2 63.9,29.2 63.2,29.9 55,29.9 49.6,35.3 | v68.4,16.2 68.4,14.5 69.75,13.15 71.95,13.15 | v28,33.5 28.1,33.5 28.1,33.6 v36.4,41.9 v39.9,41.9 v42.3,41.9 48.9,35.3 49.6,35.3 | R6.2 9.13,16.3 v22.4,16.3 | 49.6,35.3 48.9,34.6 J3.69
  Top 0.813: C1.A 47.32,51.35 C2.1 C3.1 54.4,50.35 R1.2 C4.1 59.15,50.3 60.5,50.3 R5.2
  Top 2.54: SW1.3 43.02,46.85 C1.A
  Bottom 0.61: v68.4,23.3 v68.4,16.2 | v28,33.5 28,21.9 v22.4,16.3 16.65,10.55 SV1.2 SV1.4 | v36.4,41.9 37.21,42.71 SW1.3 39.9,44.36 | 39.9,44.36 v39.9,41.9 | 39.9,44.36 42.26,42 42.3,42 v42.3,41.9
  pour Top (no thermals): 45.94,35.3 45.94,31 53.9,31 54.06,31.2 50,35.3
  pour Bottom (no thermals): 38.05,48.2 42.44,45.03 44.29,42.3 44.29,41.44 44.3,41.43 35.63,41.43 35.59,41.39 35.59,47.26 36.49,48.16
  pour Top (no thermals): 45.99,35.42 45.93,37.1 42,41.4 42,41.59 41.97,41.39 35.69,41.39 35.56,41.52 35.56,42.58 35.79,42.81 42.59,42.81 49.87,35.38 46.1,35.43
GND  (via drill 0.3 pad 0.6, 0.4 pad 0.8)
  Top 0.127: J5.4 82.3,38.4 82.6,38.1 | 82.6,38.1 82.6,37.3 | 82.6,37.3 82.5,37.2 J5.7 | 82.6,36 82.6,35.2 82.2,34.8 J5.13 79.3,34.8 77.3,32.8 74.5,32.8 IC3.14 72.45,32.84 71.2,34.1 71.2,34.6 70.5,35.3 70.5,36.09 IC3.19 | 82.6,36 82.6,37.3 | J5.10 82.6,36 | 82.6,38.1 82.6,39.4 82.4,39.6 J5.1 81.33,41.52 J5.21 | J3.4 J3.3 J3.5 | J3.6 J3.5 | 34.76,33.6 J3.8 J3.6 | 34.76,33.6 J3.7 34.5,34.6 J3.5 | 69,36.09 IC3.6 | J3.20 37.16,33.6 | 37.16,33.6 37.16,33.7 | 37.16,33.7 J3.19 | J3.31 39.56,34.22 39.31,33.97 | 39.31,33.97 39.31,32.83 39.56,32.58 J3.32 39.56,29.74 v39.8,29.5 | 39.31,33.97 39.04,33.7 37.16,33.7 | 37.16,33.6 34.76,33.6 | J3.43 41.96,33.43 42.19,33.2 42.19,32.8 41.96,32.57 J3.44 41.96,30.56 v41.6,30.2 | 33.8,34.76 33.64,34.6 J3.1 J3.2 J3.4 | J3.6 J3.4
  Top 0.406: C13.2 70.5,40.04 70.5,36.09 69,36.09 | J2.SHIELD$2 84.62,19.67 J2.GND
  Top 0.61: IC1.2 62.7,53.6 63.3,54.2 63.3,55.3 63,55.6 | 63,55.6 58.3,55.6 | C6.2 C5.2 67.2,49.1 66.65,48.55 R7.2 64.85,48.5 v62.1,48.5 | C9.2 C10.2 73.65,8.85 | SV1.40 68,5.52 | 68,5.52 70.32,5.52 | 70.32,5.52 73.65,8.85 | SV1.40 62.6,5.52 | 62.6,5.52 SV1.38 | 62.37,5.29 62.39,5.31 | 62.39,5.31 62.6,5.52 | 63,55.6 64,56.6 77.4,56.6 81.75,52.25 J5.21 85.17,41.95 J5.23 J5.22 | J5.22 85.7,26 | 87.75,17.9 J2.SHIELD$4 | 80,8.85 73.65,8.85 | R4.2 1.6,28.4 1.1,27.9 1.1,24.4 1.79,23.71 R2.2 2.36,22.84 2.9,22.3 9.6,22.3 10.42,21.48 Q1.2 | 2.7,28.65 R4.2 | IC2.2 75.55,14.15 75.9,14.5 75.9,17 | 80,11.8 80,14.4 77.4,17 75.9,17 | 80,11.8 80,8.85 | R13.1 75.9,17 | SV1.40 SV1.39 SV1.37 62.39,3 62.39,5.31 | 85.7,26 75.55,26 C11.2 C12.2 | C7.1 13.47,32.47 | 13.47,32.47 12.9,31.9 10.3,31.9 9.46,32.74 S1.A2 7.32,33.18 6.4,34.1 | 13.47,32.47 21.07,32.47 v22.1,33.5 | v33.8,37 33.8,34.76 J3.3 | C1.C 44.87,55.3 v41.9,55.3 v41.9,56.3 44.07,56.3 45.1,55.27 | v41.9,54.2 44.23,54.2 45.3,55.27 | J5.22 82.28,30.58 J5.20 | v34.7,37 34.5,36.8 34.5,34.6 | C8.1 13.47,40.67 13,40.2 10.1,40.2 9.61,40.69 S2.A2 7.57,41.97 6.4,40.8 6.4,34.1 | R4.2 2.46,30.16 6.4,34.1 | 68,5.52 68.1,5.42 68.1,2.8 68.58,2.32 U$3.1 74.42,1.6 v75.8,1.6 v77.4,1.6 v78.9,1.6 v80.3,1.6 | U$3.2 73.45,5.52 70.32,5.52 | 80,11.8 84.05,11.8 84.85,12.6 J2.SHIELD$1 85.3,13.5 J2.SHIELD$3 J2.SHIELD$4 | 85.7,26 85.7,22.8 84.8,21.9 84.8,19.95 J2.SHIELD$2 86.85,17.9 J2.SHIELD$4 | v75.8,6.2 v75.8,7.7 v77.3,7.7 | v77.3,7.7 v78.9,7.7 79.64,7.7 | 79.64,7.7 v80.3,7.7 v80.3,6.2 v78.9,6.2 v77.3,6.2 v77.3,7.7 | 80,8.85 79.5,7.84 79.64,7.7
  Top 0.813: C1.C 45.1,55.27 45.3,55.27 47.78,55.27 C2.2 C3.2 55.93,55.58 D1.C 56.92,55.6 58.3,55.6 58.3,53.05 C4.2 | J1.3 7.82,51.63 J1.2
  Bottom 0.127: v39.8,29.5 40.9,29.5 v41.6,30.2
  Bottom 0.61: J6.GND 4.67,3.07 6,4.4 | 6,4.4 6,15.4 1.2,20.2 1.2,31.2 5.9,35.9 5.9,38.43 10.92,43.45 10.92,48.53 J1.2 16.94,48.63 18.38,50.07 21.64,50.07 21.66,50.05 | 31,1.4 31.89,2.29 SV1.13 SV1.15 32.85,1.4 31,1.4 | 31,1.4 9,1.4 6,4.4 | v22.1,33.5 26,37.4 26.5,37.4 | 26.5,37.4 33.4,37.4 v33.8,37 v34.7,37 | 21.66,50.05 21.3,50.05 21.3,42.6 26.5,37.4 | 21.66,50.05 36.55,50.05 40.75,54.25 | 40.75,54.25 41.8,55.3 v41.9,55.3 | v41.9,56.3 v41.9,54.2 | v41.9,54.2 41.85,54.25 40.75,54.25 | v41.9,54.2 47.6,48.5 v62.1,48.5
  pour Bottom (isolate 0.406, rank 2, no thermals): 0,58 0,0.2 0.2,0 90,0 90,58
  pour Top (isolate 0.406, rank 2, no thermals): 0,58 0,0.2 0.2,0 90,0 90,58
N$1
  Top 2.54: J1.1 15.65,55.16 19.92,55.16 U$1.1
N$2
  Top 2.54: U$1.2 26.03,48.83 SW1.1 SW1.2
N$3
  Top 0.61: IC1.5 73.65,54.55 L1.1
N$4
  Top 0.813: D1.A R1.1
N$5
  Top 0.61: S3.8 5.34,23.71 R2.1
N$6
  Top 0.61: S3.7 R3.1
N$7
  Top 0.61: S3.5 R4.1
N$8
  Top 0.61: D2.A 4.49,19.24 R6.1
N$9
  Top 0.61: IC1.3 62.65,52.65 62.9,52.4 62.9,50.35 R5.1
  Top 0.813: R5.1 62.9,50.25 R7.1
N$10
  Top 0.61: Q1.3 7.37,21.1 D2.C
N$11
  Top 0.61: R8.1 12.08,19.2 Q1.1
N$12
  Top 0.61: C7.2 11.77,35.48 R9.1 11.67,35.58 R11.2
  Top 0.813: R11.2 9.56,37.58 S1.B2
N$13
  Top 0.61: 11.59,46.15 R12.2 11.67,44.13 | R10.1 11.67,44.13 | C8.2 11.67,42.03 11.67,44.13
  Top 0.813: R12.2 9.85,46.23 S2.B2
N$14  (via drill 0.4 pad 0.8)
  Top 0.406: IC3.13 76.31,32.2 v76.5,32 | v76.5,27.9 76.5,29.25 FB1.1
  Top 0.61: C11.1 FB1.1
  Bottom 0.406: v76.5,32 v76.5,27.9
N$15
  Top 0.61: IC2.1 77.06,13.2 D3.A 77.45,10.6 C9.1
N$16
  Top 0.127: IC3.7 68.82,35.21 69.4,35.21 70.66,33.95 70.66,31.5 71,31.16 78.18,31.16 79.16,32.14 79.16,32.98 80.58,34.4 J5.14
N$17
  Top 0.127: IC3.8 69.41,34.8 70.41,33.79 70.41,31.21 70.71,30.91 78.29,30.91 79.42,32.03 79.42,32.88 80.54,34 J5.15
N$18
  Top 0.127: J5.16 80.5,33.6 79.67,32.77 79.67,31.93 78.39,30.65 70.61,30.65 70.15,31.1 70.15,33.55 69.56,34.15 IC3.9
N$19
  Top 0.127: IC3.10 69.5,33.49 69.9,33.1 69.9,31 70.5,30.4 78.5,30.4 80.5,32.4 J5.19
N$27
  Top 0.127: FB1.2 80.85,31.9 82.2,31.9 82.5,32.2 82.5,32.6 82.3,32.8 J5.18
N$32
  Top 0.406: U$2.FEED 81.3,3.8 80.82,3.8
  Top 0.61: U$3.3 76,3.8
  Top 2: 80.82,3.8 76,3.8
VCC5P0_OTG  (via drill 0.25 pad 0.6)
  Top 0.127: 77.6,20 v77.5,20
  Top 0.2: J3.59 J3.60 45.16,29.24 45.8,28.6 60.8,28.6 69.4,20 v77.5,20
  Top 0.406: J2.VCC 81.3,15.4 81.2,15.3
  Top 0.61: v77.9,18 80.6,15.3 81.2,15.3 81.75,14.75 D3.C
  Bottom 0.406: v77.5,20 77.9,19.6 v77.9,18
VSYS_IO_3P3  (via drill 0.25 pad 0.6)
  Top 0.127: 29.05,19.25 v29.1,19.3
  Top 0.2: v40.5,22.8 40.37,22.66 J4.35 | J4.36 40.37,17.84 v40.6,17.6
  Top 0.406: R8.2 29.05,19.25
  Bottom 0.127: v40.5,22.8 40.6,22.7 40.6,21.19 40.41,21 40.41,20.6 40.6,20.41 v40.6,17.6
  Bottom 0.2: v29.1,19.3 33.85,23.45 39.85,23.45 v40.5,22.8
XADC0  (via drill 0.3 pad 0.6)
  Top 0.127: J4.3 33.97,20.87 v33.9,20.8
  Bottom 0.127: v33.9,20.8 23.1,9.6 23.1,4.1 24.22,2.98 SV1.7
XADC1
  Top 0.127: J4.4 33.97,17.46 24.27,7.77 SV1.8
XADC2  (via drill 0.3 pad 0.6)
  Top 0.127: J4.5 34.37,21.13 v34.7,20.8
  Bottom 0.127: v34.7,20.8 34.7,16.3 25.6,7.2 25.6,4.19 SV1.9
XADC3
  Top 0.127: J4.6 34.37,15.36 26.8,7.8 SV1.10
XADC4  (via drill 0.3 pad 0.6)
  Top 0.127: J4.1 33.56,21.37 v33,20.8
  Bottom 0.127: v33,20.8 20.5,8.3 20.5,4.1 21.62,2.98 SV1.5
XADC5
  Top 0.127: J4.2 33.56,17.77 23.6,7.8 22.6,7.8 21.73,6.93 SV1.6
XBOOT_CONFIG0  (via drill 0.25 pad 0.6)
  Top 0.127: 35,26.4 v34.9,26.3
  Top 0.2: J4.55 44.37,22.73 40.7,26.4 35,26.4 | v30,25.8 28.8,24.59 S3.1
  Bottom 0.2: v34.9,26.3 30.5,26.3 v30,25.8
XBOOT_CONFIG1
  Top 0.127: 14.21,25.9 S3.2 13.23,25.87 13.2,25.9 12.8,25.5 12.8,24.2 13.45,23.55 28.65,23.55 32.1,20.1 44.1,20.1 44.37,19.84 J4.56
XBOOT_CONFIG3
  Top 0.127: 14.07,28.3 S3.4 13.1,28.4 12.4,27.7 12.4,24 13.1,23.3 28.54,23.3 31.99,19.85 43.2,19.85 43.25,19.85 43.75,19.85 43.97,19.63 J4.54
XDEBUG_RX
  Top 0.127: J6.TXO 23.09,10.69 32.39,19.59 41.31,19.59 41.56,19.34 J4.42
XDEBUG_TX  (via drill 0.3 pad 0.6)
  Top 0.127: 2.84,13.3 J6.RXI
  Top 0.2: J4.41 41.56,23.63 41.2,24 v40.9,24.2 | v28,17.6 23.63,13.23 J6.RXI
  Bottom 0.127: 28,17.5 v28,17.6
  Bottom 0.2: v40.9,24.2 32.6,24.2 28,19.6 v28,17.6
XGPA15  (via drill 0.25 pad 0.6)
  Top 0.127: R13.2 70,17 60.51,26.49 45.99,26.49 45.08,27.4 v44.3,27.4 | v44.3,33.3 44.36,33.36 J3.55
  Top 0.61: IC2.4 71.9,16.95 R13.2
  Bottom 0.127: v44.3,27.4 v44.3,33.3
XGPA21  (via drill 0.25 pad 0.6, 0.3 pad 0.6)
  Top 0.127: J4.61 45.56,23.16 46.9,24.5 54.9,24.5 v56,25.6 | v63.91,32.2 v63.9,32.2 63.9,34.3 66.34,36.74 IC3.5 | v67.2,32.2 IC3.12
  Bottom 0.127: v56,25.6 62.6,32.2 v63.9,32.2 v67.2,32.2
XGPIO0
  Top 0.127: J4.12 35.56,14.46 29.3,8.2 29.3,5.57 SV1.12
XGPIO1  (via drill 0.25 pad 0.6)
  Top 0.127: J4.13 35.97,21.16 v35.6,20.8
  Bottom 0.127: v35.6,20.8 34.95,20.15 34.95,16.2 28,9.24 28,4.33 SV1.11
XGPIO2
  Top 0.127: J4.14 35.97,11.36 31.89,7.29 SV1.14
XGPIO3
  Top 0.127: J4.16 36.37,9.27 34.4,7.3 34.4,5.55 SV1.16
XGPIO4  (via drill 0.3 pad 0.6)
  Top 0.127: J4.37 40.77,20.94 v40.9,20.8
  Bottom 0.127: SV1.29 50.9,4.29 50.9,10.8 45.99,15.71 42,15.71 41.15,16.56 41.15,20.55 v40.9,20.8
XGPIO5
  Top 0.127: J4.40 41.16,17.54 41.7,17 42.4,17 52.21,7.19 SV1.30
XGPIO6  (via drill 0.25 pad 0.6)
  Top 0.127: J4.39 41.16,21.34 41.7,20.8 v42.4,20.8
  Bottom 0.127: v42.4,20.8 42.99,20.21 42.99,19.54 53.5,9.03 53.5,4.23 SV1.31
XGPIO7
  Top 0.127: J4.59 45.16,21.23 46.4,20 48.9,20 61.2,7.7 61.2,4.6 60.9,4.3 55.97,4.3 SV1.32
XHDMI_CEC  (via drill 0.3 pad 0.6)
  Top 0.127: IC3.1 68.54,39.3 61.1,39.3 60,40.4 v56.9,40.4 | v40.8,40.4 39.96,39.56 J3.33
  Bottom 0.127: v40.8,40.4 v56.9,40.4
XHDMI_HPD  (via drill 0.25 pad 0.6)
  Top 0.127: J3.34 39.96,30.74 45.1,25.6 v52.4,25.6 | v63.4,34.7 66.09,37.4 IC3.4
  Bottom 0.127: v52.4,25.6 54.3,25.6 v63.4,34.7
XHDMI_I2C_SCL  (via drill 0.25 pad 0.6)
  Top 0.127: J4.33 39.97,23.7 39.97,24.56 v40.2,24.8 | v53.4,34.4 57.69,38.7 IC3.2
  Bottom 0.127: v40.2,24.8 41.7,26.3 45.3,26.3 v53.4,34.4
XHDMI_I2C_SDA  (via drill 0.25 pad 0.6)
  Top 0.127: IC3.3 58.75,38.05 v54.2,33.7 | v42.2,16.2 40.8,16.2 39.97,17.04 J4.34
  Bottom 0.127: v54.2,33.7 44.2,23.5 42.8,23.5 41.65,22.35 41.65,20.75 42.2,20.21 v42.2,16.2
XHDMI_TX0_N  (via drill 0.25 pad 0.6)
  Top 0.127: J5.9 81.3,36.37 79.75,36.37 79.35,35.97 77.55,35.97 76.38,34.8 IC3.17 72.11,34.8 v71.4,35.5 | J3.39 41.16,35.76 41.81,36.41 v42.1,36.41
  Bottom 0.127: v71.4,35.5 71.3,35.61 71.3,35.94 70.19,37.05 60.4,37.05 arc90 60.18,36.82 60.18,36.82 arc-90 59.96,36.59 59.94,36.59 arc-90 59.72,36.82 59.72,36.82 arc90 59.5,37.05 59.48,37.05 arc90 59.26,36.82 59.26,36.82 arc-90 59.04,36.59 59.03,36.59 arc-90 58.81,36.82 58.81,36.82 arc90 58.58,37.05 58.57,37.05 arc90 58.35,36.82 58.35,36.82 arc-90 58.12,36.59 58.11,36.59 arc-90 57.89,36.82 57.89,36.82 arc90 57.67,37.05 57.65,37.05 arc90 57.43,36.82 57.43,36.82 arc-90 57.21,36.59 57.2,36.59 arc-90 56.97,36.82 56.97,36.82 arc90 56.75,37.05 56.74,37.05 arc90 56.52,36.82 56.52,36.82 arc-90 56.3,36.59 56.28,36.59 arc-90 56.06,36.82 56.06,36.82 arc90 55.84,37.05 55.82,37.05 arc90 55.6,36.82 55.6,36.82 arc-90 55.38,36.59 55.37,36.59 arc-90 55.14,36.82 55.14,36.82 arc90 54.92,37.05 42.74,37.05 v42.1,36.41
XHDMI_TX0_P  (via drill 0.25 pad 0.6)
  Top 0.127: J5.8 80.6,36.8 80.43,36.63 79.65,36.63 79.25,36.23 77.45,36.23 76.61,35.39 74.51,35.39 IC3.18 74.41,35.4 v72.2,35.4 | J3.40 41.16,33.64 v41.1,33.8
  Bottom 0.127: v41.1,33.8 41.1,36.1 42.3,37.3 70.3,37.3 v72.2,35.4
XHDMI_TX1_N  (via drill 0.25 pad 0.6)
  Top 0.127: J5.6 79.78,37.6 79.15,36.97 75.47,36.97 75.3,36.8 74.51,36.8 IC3.20 72.03,36.74 v71.79,36.99 | v40.95,36.95 40.76,36.77 J3.37
  Bottom 0.127: v40.95,36.95 40.95,37.59 41.41,38.05 46.33,38.05 arc-90 46.55,37.82 46.55,37.82 arc90 46.77,37.6 46.81,37.6 arc90 47.04,37.82 47.04,37.82 arc-90 47.26,38.05 47.3,38.05 arc-90 47.52,37.82 47.52,37.82 arc90 47.75,37.6 47.79,37.6 arc90 48.01,37.82 48.01,37.82 arc-90 48.23,38.05 48.27,38.05 arc-90 48.5,37.82 48.5,37.82 arc90 48.72,37.6 48.76,37.6 arc90 48.98,37.82 48.98,37.82 arc-90 49.21,38.05 49.25,38.05 arc-90 49.47,37.82 49.47,37.82 arc90 49.69,37.6 49.73,37.6 arc90 49.96,37.82 49.96,37.82 arc-90 50.18,38.05 50.22,38.05 arc-90 50.44,37.82 50.44,37.82 arc90 50.67,37.6 50.71,37.6 arc90 50.93,37.82 50.93,37.82 arc-90 51.15,38.05 51.2,38.05 arc-90 51.42,37.82 51.42,37.82 arc90 51.64,37.6 51.68,37.6 arc90 51.9,37.82 51.9,37.82 arc-90 52.13,38.05 52.17,38.05 arc-90 52.39,37.82 52.39,37.82 arc90 52.61,37.6 52.66,37.6 arc90 52.88,37.82 52.88,37.82 arc-90 53.1,38.05 70.73,38.05 v71.79,36.99
XHDMI_TX1_P  (via drill 0.25 pad 0.6)
  Top 0.127: J5.5 79.82,38 79.05,37.23 75.47,37.23 75.3,37.4 IC3.21 74.36,37.3 73.3,37.3 73.1,37.5 v72.3,37.5 | J3.38 40.76,33.04 v40.6,33.1
  Bottom 0.127: v40.6,33.1 40.4,33.4 40.4,37.4 41.3,38.3 71.5,38.3 v72.3,37.5
XHDMI_TX2_N  (via drill 0.25 pad 0.6)
  Top 0.127: J5.3 79.28,38.8 78.65,38.17 75.7,38.17 75.53,38 74.5,38 IC3.22 | J3.35 40.36,33.99 40.14,33.76 v39.8,33.76 | 74.41,38 IC3.22 | IC3.22 73.13,38.05 v72.9,38.27
  Bottom 0.127: v39.8,33.76 39.22,33.76 38.83,34.15 38.83,38.15 40.03,39.35 45.45,39.35 arc-90 45.67,39.12 45.67,38.98 arc90 45.9,38.76 45.93,38.76 arc90 46.15,38.98 46.15,39.12 arc-90 46.37,39.35 46.4,39.35 arc-90 46.63,39.12 46.63,38.98 arc90 46.85,38.76 46.88,38.76 arc90 47.1,38.98 47.1,39.12 arc-90 47.33,39.35 47.36,39.35 arc-90 47.58,39.12 47.58,38.98 arc90 47.8,38.76 47.83,38.76 arc90 48.05,38.98 48.05,39.12 arc-90 48.28,39.35 48.31,39.35 arc-90 48.53,39.12 48.53,38.98 arc90 48.75,38.76 48.79,38.76 arc90 49.01,38.98 49.01,39.12 arc-90 49.23,39.35 49.26,39.35 arc-90 49.48,39.12 49.48,38.98 arc90 49.71,38.76 49.74,38.76 arc90 49.96,38.98 49.96,39.12 arc-90 50.18,39.35 50.22,39.35 arc-90 50.44,39.12 50.44,38.98 arc90 50.66,38.76 50.69,38.76 arc90 50.91,38.98 50.91,39.12 arc-90 51.14,39.35 51.17,39.35 arc-90 51.39,39.12 51.39,38.98 arc90 51.61,38.76 51.64,38.76 arc90 51.87,38.98 51.87,39.12 arc-90 52.09,39.35 52.12,39.35 arc-90 52.34,39.12 52.34,38.98 arc90 52.56,38.76 52.6,38.76 arc90 52.82,38.98 52.82,39.12 arc-90 53.04,39.35 53.07,39.35 arc-90 53.3,39.12 53.3,38.98 arc90 53.52,38.76 53.55,38.76 arc90 53.77,38.98 53.77,39.12 arc-90 53.99,39.35 54.03,39.35 arc-90 54.25,39.12 54.25,38.98 arc90 54.47,38.76 54.5,38.76 arc90 54.72,38.98 54.72,39.12 arc-90 54.95,39.35 54.98,39.35 arc-90 55.2,39.12 55.2,38.98 arc90 55.42,38.76 55.46,38.76 arc90 55.68,38.98 55.68,39.12 arc-90 55.9,39.35 71.83,39.35 v72.9,38.27
XHDMI_TX2_P  (via drill 0.25 pad 0.6)
  Top 0.127: J5.2 79.32,39.2 78.55,38.43 75.67,38.43 75.4,38.7 IC3.23 | IC3.23 | J3.36 40.36,32.58 v39.8,33.04 | IC3.23 73.2,38.7 v72.9,39
  Bottom 0.127: v39.8,33.04 39.48,33.14 38.57,34.05 38.57,38.25 39.92,39.6 72.3,39.6 v72.9,39
XHDMI_TXC_N  (via drill 0.25 pad 0.6)
  Top 0.127: J5.12 80.5,35.2 80.43,35.27 79.05,35.27 77.28,33.49 IC3.15 74.44,33.47 v72.7,33.47 | J3.41 41.56,35.06 42.4,35.9 43,35.9 v43.1,35.8
  Bottom 0.127: v43.1,35.8 43.7,35.8 43.95,36.05 53.66,36.05 arc-90 53.88,35.82 53.88,35.78 arc90 54.1,35.56 54.11,35.56 arc90 54.34,35.78 54.34,35.82 arc-90 54.56,36.05 54.57,36.05 arc-90 54.79,35.82 54.79,35.78 arc90 55.01,35.56 55.02,35.56 arc90 55.25,35.78 55.25,35.82 arc-90 55.47,36.05 55.48,36.05 arc-90 55.7,35.82 55.7,35.78 arc90 55.92,35.56 55.94,35.56 arc90 56.16,35.78 56.16,35.82 arc-90 56.38,36.05 56.39,36.05 arc-90 56.61,35.82 56.61,35.78 arc90 56.83,35.56 56.84,35.56 arc90 57.07,35.78 57.07,35.82 arc-90 57.29,36.05 57.3,36.05 arc-90 57.52,35.82 57.52,35.78 arc90 57.75,35.56 57.75,35.56 arc90 57.98,35.78 57.98,35.82 arc-90 58.2,36.05 69.69,36.05 71.8,33.95 72.15,33.95 72.63,33.47 v72.7,33.47
XHDMI_TXC_P  (via drill 0.25 pad 0.6)
  Top 0.127: J5.11 80.5,35.6 80.43,35.53 78.95,35.53 77.52,34.1 74.5,34.1 IC3.16 73.86,34.15 73.8,34.2 v72.7,34.2 | J3.42 41.56,32.16 41.7,32.3 v41.7,33
  Bottom 0.127: v72.7,34.2 71.9,34.2 69.8,36.3 42.8,36.3 41.7,35.2 v41.7,33
XI2C_SCL0  (via drill 0.3 pad 0.6)
  Top 0.127: J4.31 39.56,22.63 v39.4,22.8
  Bottom 0.127: v39.4,22.8 39.4,21.69 40.09,21 40.09,20.41 39.85,20.17 39.85,15.35 48.4,6.8 48.4,4.25 SV1.27
XI2C_SCL1  (via drill 0.3 pad 0.6)
  Top 0.127: J4.29 39.16,21.13 v39.6,20.8
  Bottom 0.127: SV1.25 45.8,4.31 45.8,6.2 39.6,12.4 v39.6,20.8
XI2C_SCL2  (via drill 0.3 pad 0.6)
  Top 0.127: J4.27 38.77,20.84 v38.8,20.8
  Bottom 0.127: SV1.23 43.3,4.27 43.3,6.2 38.8,10.7 v38.8,20.8
XI2C_SDA0
  Top 0.127: J4.32 39.56,15.62 40.24,14.95 SV1.28
XI2C_SDA1
  Top 0.127: J4.30 39.16,13.48 SV1.26
XI2C_SDA2
  Top 0.127: J4.28 38.77,11.34 SV1.24
XNRESET
  Top 0.127: 32.95,25.95 33,25.9
  Top 0.2: R10.2 14.83,44.07 32.95,25.95 | 33,25.9 35.56,23.34 J4.11
XOTG_D_N  (via drill 0.25 pad 0.6)
  Top 0.127: J3.45 42.36,33.74 v42.5,33.6 | v42.95,29.55 43.31,29.2 43.64,29.2 46.09,26.75 60.77,26.75 68.85,18.67 78.75,18.67 81.12,16.3 83.5,16.3 83.75,16.05 J2.D-
  Bottom 0.127: v42.5,33.6 42.5,30.1 42.95,29.65 v42.95,29.55
XOTG_D_P
  Top 0.127: J3.46 42.36,30.84 46.2,27 48.04,27 arc90 48.27,27.22 48.27,27.23 arc-90 48.49,27.45 48.56,27.45 arc-90 48.78,27.23 48.78,27.22 arc90 49,27 49.08,27 arc90 49.3,27.22 49.3,27.23 arc-90 49.52,27.45 49.59,27.45 arc-90 49.81,27.23 49.81,27.22 arc90 50.04,27 50.11,27 arc90 50.33,27.22 50.33,27.23 arc-90 50.55,27.45 50.62,27.45 arc-90 50.85,27.23 50.85,27.22 arc90 51.07,27 51.14,27 arc90 51.36,27.22 51.36,27.23 arc-90 51.59,27.45 51.66,27.45 arc-90 51.88,27.23 51.88,27.22 arc90 52.1,27 52.17,27 arc90 52.4,27.22 52.4,27.23 arc-90 52.62,27.45 52.69,27.45 arc-90 52.91,27.23 52.91,27.22 arc90 53.14,27 53.21,27 arc90 53.43,27.22 53.43,27.23 arc-90 53.65,27.45 53.72,27.45 arc-90 53.94,27.23 53.94,27.22 arc90 54.17,27 54.24,27 arc90 54.46,27.22 54.46,27.23 arc-90 54.68,27.45 54.75,27.45 arc-90 54.98,27.23 54.98,27.22 arc90 55.2,27 60.88,27 68.95,18.93 78.85,18.93 81.19,16.59 83.49,16.59 83.6,16.7 J2.D+
XOTG_ID
  Top 0.127: J3.50 43.16,30.64 46,27.8 60.7,27.8 69.32,19.18 78.96,19.18 80.79,17.35 82.7,17.35 | 82.7,17.35 J2.ID | R14.1 82.75,17.4 82.7,17.35
XPWERKEY
  Top 0.2: R9.2 22.38,35.52 35.16,22.73 J4.9
XPWM0
  Top 0.127: SV1.22 38.37,9.2 J4.26
XPWM1  (via drill 0.3 pad 0.6)
  Top 0.127: J4.25 38.37,21.14 v38.03,20.8
  Bottom 0.127: v38.03,20.8 38.03,13.1 38.03,12.03 38.03,8.87 40.8,6.1 40.8,4.23 SV1.21
XSPI_CLK  (via drill 0.3 pad 0.6)
  Top 0.127: J4.23 37.97,21.47 v37.3,20.8
  Bottom 0.127: SV1.19 38.3,4.19 38.3,6.1 37.3,7.1 v37.3,20.8
XSPI_CS
  Top 0.127: SV1.20 37.97,7.07 J4.24
XSPI_MISO  (via drill 0.3 pad 0.6)
  Top 0.127: J4.21 37.56,21.47 37.4,21.3 36.9,21.3 v36.5,20.8
  Bottom 0.127: SV1.17 35.8,4.15 35.8,6.2 36.5,6.9 v36.5,20.8
XSPI_MOSI
  Top 0.127: SV1.18 36.9,5.59 36.9,7.5 37.56,8.16 J4.22
XUART_RX0
  Top 0.127: J4.46 42.37,18.44 42.85,17.95 46.7,17.95 57.86,6.8 58,6.8 58.55,6.8 SV1.36
XUART_RX1
  Top 0.127: J4.44 41.97,18.34 42.6,17.7 46.6,17.7 57.3,7 SV1.34
XUART_TX0  (via drill 0.25 pad 0.6)
  Top 0.127: J4.45 42.37,22.56 42.6,22.8 v42.9,22.8
  Bottom 0.127: SV1.35 58.6,4.21 58.6,6.2 44,20.8 44,21.7 v42.9,22.8
XUART_TX1  (via drill 0.3 pad 0.6)
  Top 0.127: J4.43 41.97,21.44 42.11,21.29 42.6,21.29 43.09,20.8 v43.2,20.8
  Bottom 0.127: v43.2,20.8 43.3,19.6 56,6.9 56,4.1 57.12,2.98 SV1.33

### Text on the board
tPlace: PWR LED | + | 1 | 69 | 2 | 70 | 1 | 69 | 2 | 70 | VSYS LED
tNames: SW eMMC SD USB / 1 OFF OFF ON / 2 OFF OFF ON / 3 X X X / 4 OFF ON X | FUSE | HDMI | RESET | POWER | 4 | 3 | 2 | 1 | USB OTG | TX | RX | DEBUG | 5V | 5V | ADC5 | ADC1 | ADC3 | GP0 | GP2 | GP3 | MOSI | CS | PWM0 | SDA2 | SDA1 | SDA0 | GP5 | GP7 | RX1 | RX0 | GND | WIFI/BT ANT | GND | 3.3V | ADC4 | ADC0 | ADC2 | GP1 | GND | GND | MISO | CLK | PWM1 | SCL2 | SCL1 | SCL0 | GP4 | GP6 | TX1 | TX0 | GND | GND
tStop: JORGE GARZA / ARTIK530 / CARRIERBOARD / REV0